# EAGLE design io-16x-fused-fm_v1.0.0 (EAGLE 9.6.2)
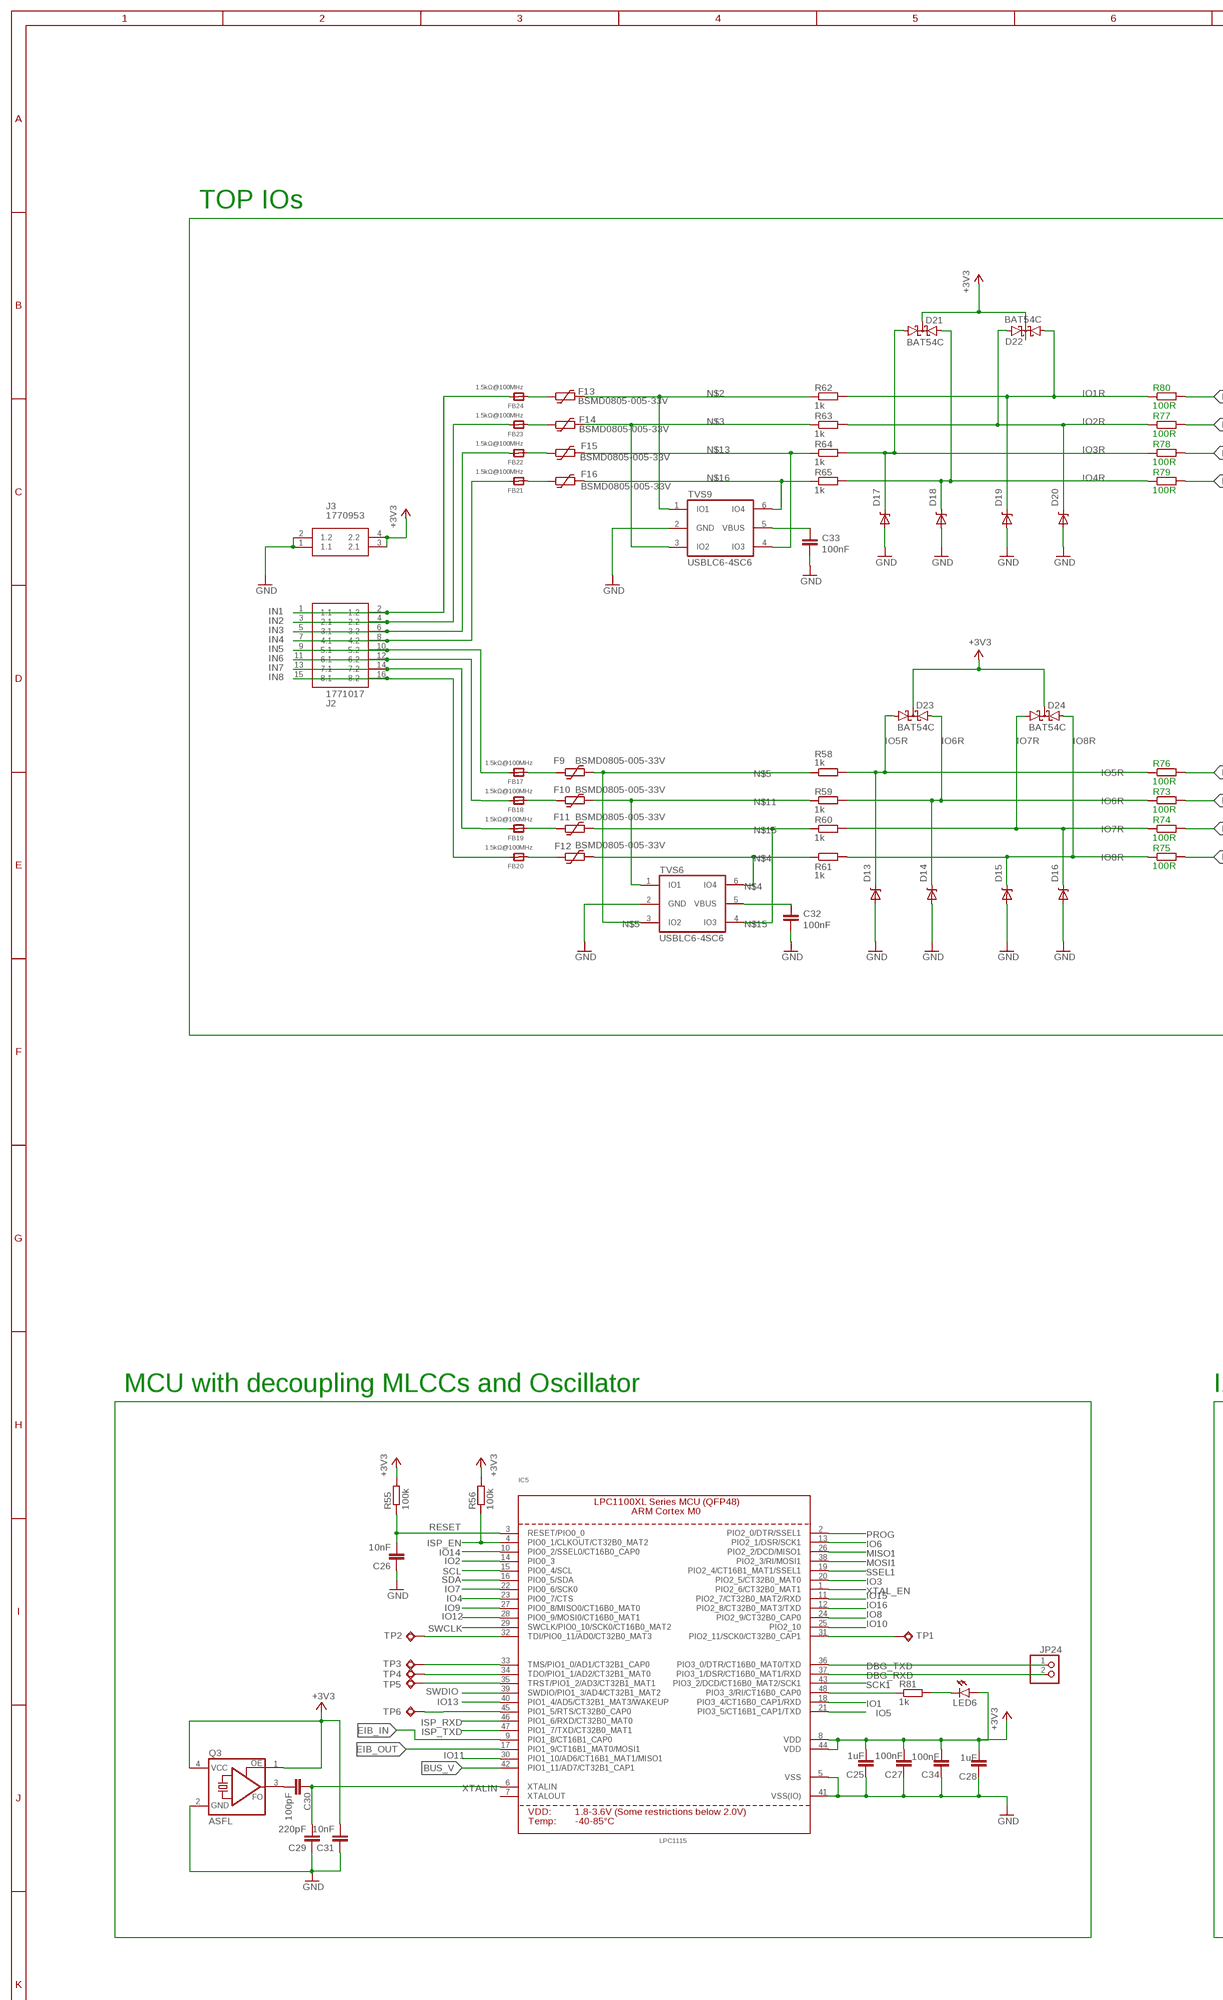
[diagram p0: schematic, sheet 1, part 1 of 3]
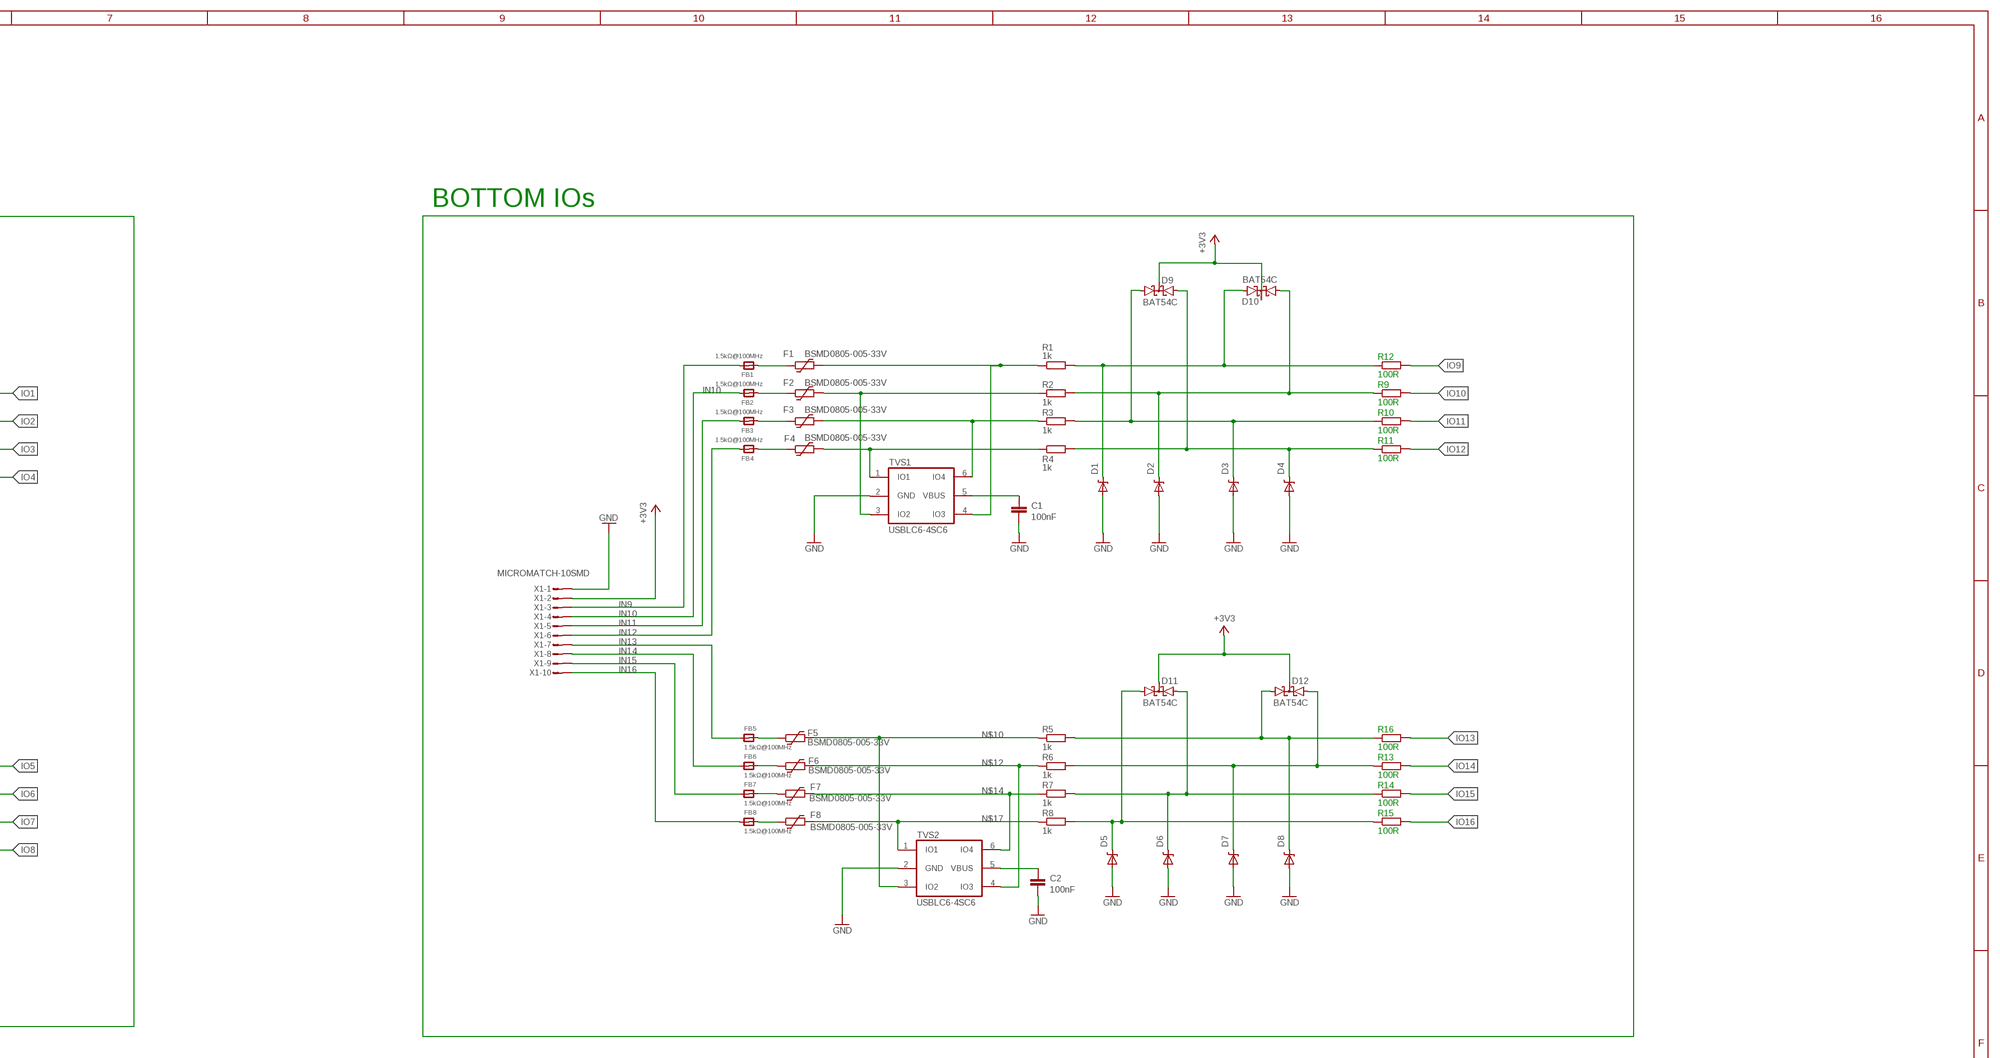
[diagram p1: schematic, sheet 1, part 2 of 3]
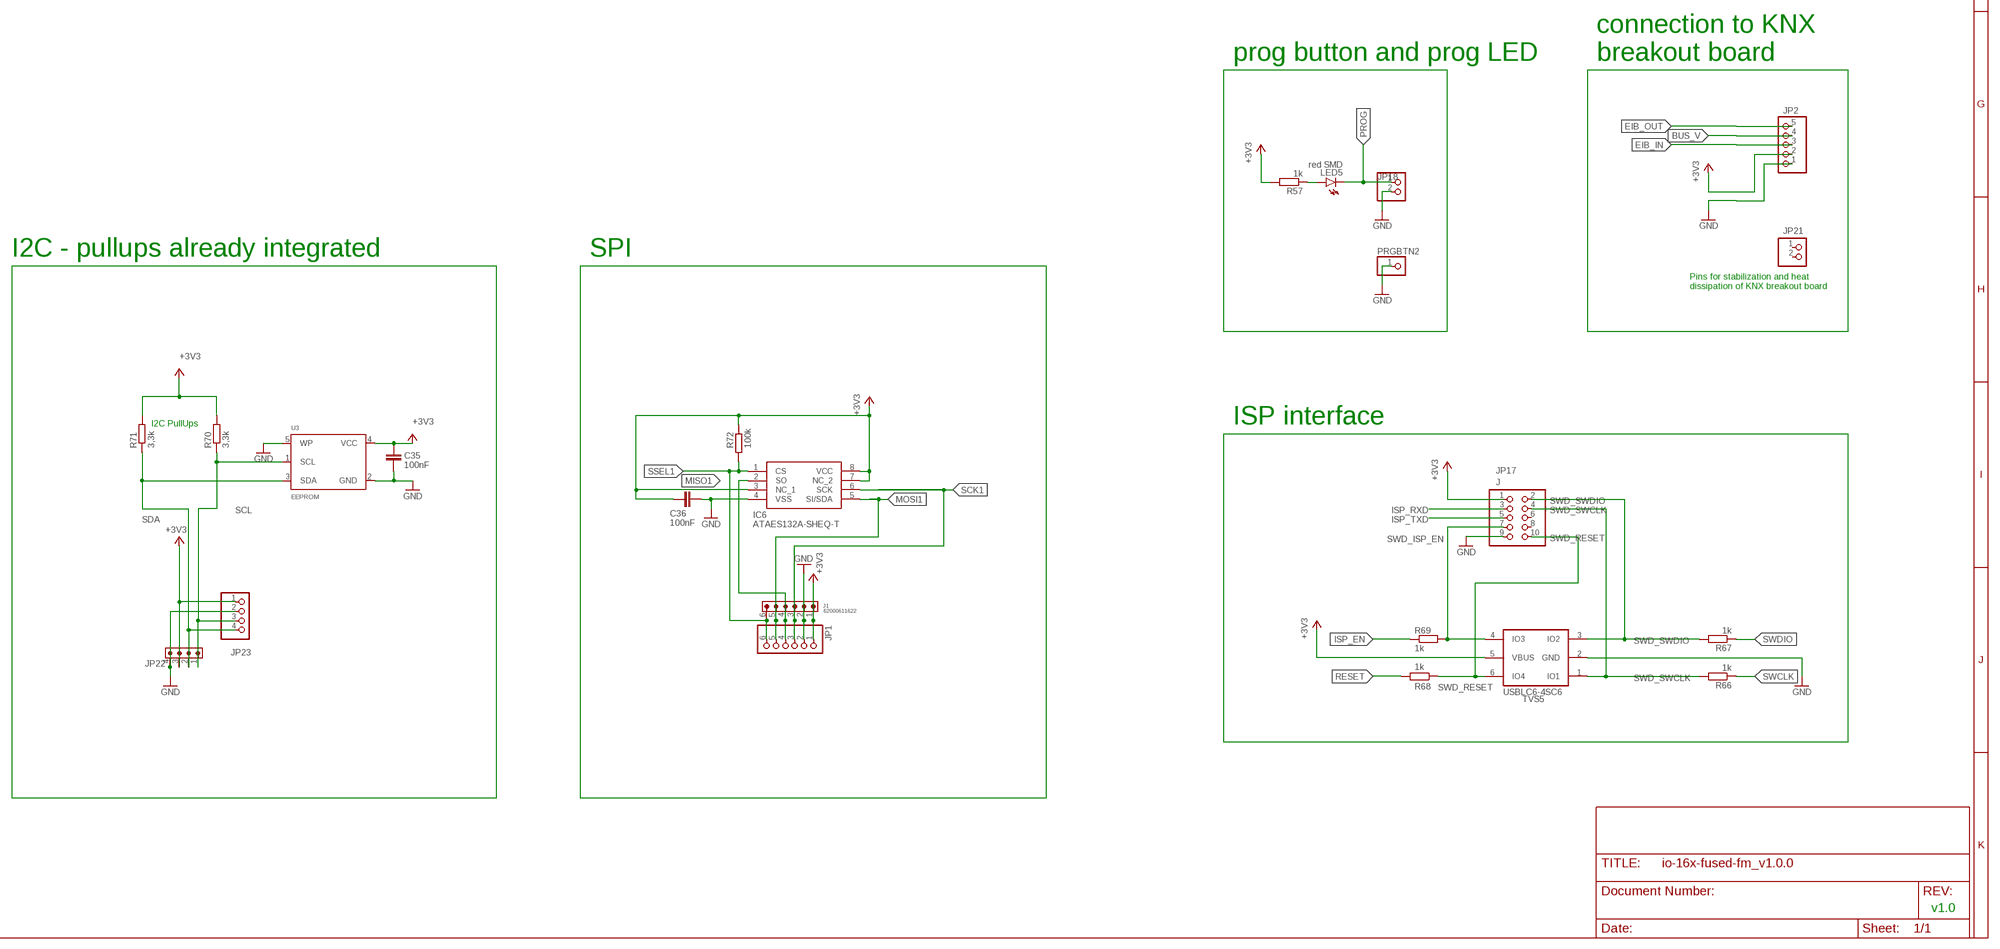
[diagram p2: schematic, sheet 1, part 3 of 3]

## Parts
C1  100nF  C-EUC0805  [C0805]
C2  100nF  C-EUC0805  [C0805]
C25  1uF  C-EUC0805  [C0805]
C26  10nF  C-EUC0805  [C0805]
C27  100nF  C-EUC0805  [C0805]
C28  1uF  C-EUC0805  [C0805]
C29  220pF  C-EUC0805  [C0805]
C30  100pF  C-EUC0805  [C0805]
C31  10nF  C-EUC0805  [C0805]
C32  100nF  C-EUC0805  [C0805]
C33  100nF  C-EUC0805  [C0805]
C34  100nF  C-EUC0805  [C0805]
C35  100nF  C-EUC0805  [C0805]
C36  100nF  C-EUC0805  [C0805]
D1  DDZ9684  DIODE-ZENERSOD-123  [SOD-123]
D2  DDZ9684  DIODE-ZENERSOD-123  [SOD-123]
D3  DDZ9684  DIODE-ZENERSOD-123  [SOD-123]
D4  DDZ9684  DIODE-ZENERSOD-123  [SOD-123]
D5  DDZ9684  DIODE-ZENERSOD-123  [SOD-123]
D6  DDZ9684  DIODE-ZENERSOD-123  [SOD-123]
D7  DDZ9684  DIODE-ZENERSOD-123  [SOD-123]
D8  DDZ9684  DIODE-ZENERSOD-123  [SOD-123]
D9  BAT54C  [SOT23]
D10  BAT54C  [SOT23]
D11  BAT54C  [SOT23]
D12  BAT54C  [SOT23]
D13  DDZ9684  DIODE-ZENERSOD-123  [SOD-123]
D14  DDZ9684  DIODE-ZENERSOD-123  [SOD-123]
D15  DDZ9684  DIODE-ZENERSOD-123  [SOD-123]
D16  DDZ9684  DIODE-ZENERSOD-123  [SOD-123]
D17  DDZ9684  DIODE-ZENERSOD-123  [SOD-123]
D18  DDZ9684  DIODE-ZENERSOD-123  [SOD-123]
D19  DDZ9684  DIODE-ZENERSOD-123  [SOD-123]
D20  DDZ9684  DIODE-ZENERSOD-123  [SOD-123]
D21  BAT54C  [SOT23]
D22  BAT54C  [SOT23]
D23  BAT54C  [SOT23]
D24  BAT54C  [SOT23]
F1  BSMD0805-005-33V  0805L035  [0805L]
F2  BSMD0805-005-33V  0805L035  [0805L]
F3  BSMD0805-005-33V  0805L035  [0805L]
F4  BSMD0805-005-33V  0805L035  [0805L]
F5  BSMD0805-005-33V  0805L035  [0805L]
F6  BSMD0805-005-33V  0805L035  [0805L]
F7  BSMD0805-005-33V  0805L035  [0805L]
F8  BSMD0805-005-33V  0805L035  [0805L]
F9  BSMD0805-005-33V  0805L035  [0805L]
F10  BSMD0805-005-33V  0805L035  [0805L]
F11  BSMD0805-005-33V  0805L035  [0805L]
F12  BSMD0805-005-33V  0805L035  [0805L]
F13  BSMD0805-005-33V  0805L035  [0805L]
F14  BSMD0805-005-33V  0805L035  [0805L]
F15  BSMD0805-005-33V  0805L035  [0805L]
F16  BSMD0805-005-33V  0805L035  [0805L]
FB1  1.5kΩ@100MHz  FERRITE2_0805MP  [FERR_0805MP]
FB2  1.5kΩ@100MHz  FERRITE2_0805MP  [FERR_0805MP]
FB3  1.5kΩ@100MHz  FERRITE2_0805MP  [FERR_0805MP]
FB4  1.5kΩ@100MHz  FERRITE2_0805MP  [FERR_0805MP]
FB5  1.5kΩ@100MHz  FERRITE2_0805MP  [FERR_0805MP]
FB6  1.5kΩ@100MHz  FERRITE2_0805MP  [FERR_0805MP]
FB7  1.5kΩ@100MHz  FERRITE2_0805MP  [FERR_0805MP]
FB8  1.5kΩ@100MHz  FERRITE2_0805MP  [FERR_0805MP]
FB17  1.5kΩ@100MHz  FERRITE2_0805MP  [FERR_0805MP]
FB18  1.5kΩ@100MHz  FERRITE2_0805MP  [FERR_0805MP]
FB19  1.5kΩ@100MHz  FERRITE2_0805MP  [FERR_0805MP]
FB20  1.5kΩ@100MHz  FERRITE2_0805MP  [FERR_0805MP]
FB21  1.5kΩ@100MHz  FERRITE2_0805MP  [FERR_0805MP]
FB22  1.5kΩ@100MHz  FERRITE2_0805MP  [FERR_0805MP]
FB23  1.5kΩ@100MHz  FERRITE2_0805MP  [FERR_0805MP]
FB24  1.5kΩ@100MHz  FERRITE2_0805MP  [FERR_0805MP]
IC5  LPC1115  LPC1113/4/5_QFP48_XLSERIES  [LQFP48]
IC6  ATAES132A-SHEQ-T  [SOIC127P600X175-8N]
J1  62000611622  62000611622  [62000611622]
J2  1771017  [1771017]
J3  1770953  [1770953]
JP1  PINHD-1X06_2.54-S  [1X06-S]
JP2  PINHD-1X5  [1X05]
JP17  J  PINHD-2X05_2.00  [2X05M]
JP18  PINHD-1X2  [1X02]
JP21  PINHD-1X2  [1X02]
JP22  62000411622  62000411622  [62000411622]
JP23  PINHD-1X4  [1X04]
JP24  PINHD-1X2  [1X02]
LED5  red SMD  LEDCHIPLED_0805  [CHIPLED_0805]
LED6  LEDCHIPLED_0805  [CHIPLED_0805]
PRGBTN2  PINHD-1X1  [1X01]
Q3  ASFL  [ASF]
R1  1k  R-EU_R0805  [R0805]
R2  1k  R-EU_R0805  [R0805]
R3  1k  R-EU_R0805  [R0805]
R4  1k  R-EU_R0805  [R0805]
R5  1k  R-EU_R0805  [R0805]
R6  1k  R-EU_R0805  [R0805]
R7  1k  R-EU_R0805  [R0805]
R8  1k  R-EU_R0805  [R0805]
R9  100R  R-EU_R0805  [R0805]
R10  100R  R-EU_R0805  [R0805]
R11  100R  R-EU_R0805  [R0805]
R12  100R  R-EU_R0805  [R0805]
R13  100R  R-EU_R0805  [R0805]
R14  100R  R-EU_R0805  [R0805]
R15  100R  R-EU_R0805  [R0805]
R16  100R  R-EU_R0805  [R0805]
R55  100k  R-EU_R0805  [R0805]
R56  100k  R-EU_R0805  [R0805]
R57  1k  R-EU_R0805  [R0805]
R58  1k  R-EU_R0805  [R0805]
R59  1k  R-EU_R0805  [R0805]
R60  1k  R-EU_R0805  [R0805]
R61  1k  R-EU_R0805  [R0805]
R62  1k  R-EU_R0805  [R0805]
R63  1k  R-EU_R0805  [R0805]
R64  1k  R-EU_R0805  [R0805]
R65  1k  R-EU_R0805  [R0805]
R66  1k  R-EU_R0805  [R0805]
R67  1k  R-EU_R0805  [R0805]
R68  1k  R-EU_R0805  [R0805]
R69  1k  R-EU_R0805  [R0805]
R70  3,3k  R-EU_R0805  [R0805]
R71  3,3k  R-EU_R0805  [R0805]
R72  100k  R-EU_R0805  [R0805]
R73  100R  R-EU_R0805  [R0805]
R74  100R  R-EU_R0805  [R0805]
R75  100R  R-EU_R0805  [R0805]
R76  100R  R-EU_R0805  [R0805]
R77  100R  R-EU_R0805  [R0805]
R78  100R  R-EU_R0805  [R0805]
R79  100R  R-EU_R0805  [R0805]
R80  100R  R-EU_R0805  [R0805]
R81  1k  R-EU_R0805  [R0805]
TP1  TPSQTP08R  [TP08R]
TP2  TPSQTP08R  [TP08R]
TP3  TPSQTP08R  [TP08R]
TP4  TPSQTP08R  [TP08R]
TP5  TPSQTP08R  [TP08R]
TP6  TPSQTP08R  [TP08R]
TVS1  USBLC6-4SC6  [SOT-23-6L]
TVS2  USBLC6-4SC6  [SOT-23-6L]
TVS5  USBLC6-4SC6  [SOT-23-6L]
TVS6  USBLC6-4SC6  [SOT-23-6L]
TVS9  USBLC6-4SC6  [SOT-23-6L]
U3  EEPROM  EEPROM_I2C_MCP24AA32  [SOT23-5]
X1  MICROMATCH-10SMD  [MICROMATCH-10SMD]

## Nets
+3V3: C25.2 C27.2 C28.2 C31.2 C34.2 C35.1 C36.1 D9.3(CC) D10.3(CC) D11.3(CC) D12.3(CC) D21.3(CC) D22.3(CC) D23.3(CC) D24.3(CC) IC5.8(VDD) IC5.44(VDD) IC6.3(NC_1) IC6.7(NC_2) IC6.8(VCC) J1.1 J3.3(2.1) J3.4(2.2) JP1.1 JP2.2 JP17.1 JP22.3 JP23.1 LED6.A Q3.1(OE) Q3.4(VCC) R55.2 R56.2 R57.2 R70.2 R71.2 R72.2 TVS5.5(VBUS) U3.4(VCC) X1.2
BUS_V: IC5.42(PIO1_11/AD7/CT32B1_CAP1) JP2.4
DBG_RXD: IC5.37(PIO3_1/DSR/CT16B0_MAT1/RXD) JP24.2
DBG_TXD: IC5.36(PIO3_0/DTR/CT16B0_MAT0/TXD) JP24.1
EIB_IN: IC5.9(PIO1_8/CT16B1_CAP0) JP2.3
EIB_OUT: IC5.17(PIO1_9/CT16B1_MAT0/MOSI1) JP2.5
GND: C1.1 C2.1 C25.1 C26.1 C27.1 C28.1 C29.1 C31.1 C32.1 C33.1 C34.1 C35.2 C36.2 D1.A D2.A D3.A D4.A D5.A D6.A D7.A D8.A D13.A D14.A D15.A D16.A D17.A D18.A D19.A D20.A IC5.5(VSS) IC5.41(VSS(IO)) IC6.4(VSS) J1.2 J3.1(1.1) J3.2(1.2) JP1.2 JP2.1 JP17.9 JP18.2 JP22.4 JP23.2 PRGBTN2.1 Q3.2(GND) TVS1.2(GND) TVS2.2(GND) TVS5.2(GND) TVS6.2(GND) TVS9.2(GND) U3.2(GND) U3.5(WP) X1.1
IN1: FB24.2 J2.1(1.1) J2.2(1.2)
IN2: FB23.2 J2.3(2.1) J2.4(2.2)
IN3: FB22.2 J2.5(3.1) J2.6(3.2)
IN4: FB21.2 J2.7(4.1) J2.8(4.2)
IN5: FB17.2 J2.9(5.1) J2.10(5.2)
IN6: FB18.2 J2.11(6.1) J2.12(6.2)
IN7: FB19.2 J2.13(7.1) J2.14(7.2)
IN8: FB20.2 J2.15(8.1) J2.16(8.2)
IN9: FB1.2 X1.3
IN10: FB2.2 X1.4
IN11: FB3.2 X1.5
IN12: FB4.2 X1.6
IN13: FB5.1 X1.7
IN14: FB6.1 X1.8
IN15: FB7.1 X1.9
IN16: FB8.1 X1.10
IO1: IC5.18(PIO3_4/CT16B0_CAP1/RXD) R80.2
IO1R: D19.C D22.1(A1) R62.2 R80.1
IO2: IC5.14(PIO0_3) R77.2
IO2R: D20.C D22.2(A2) R63.2 R77.1
IO3: IC5.20(PIO2_5/CT32B0_MAT0) R78.2
IO3R: D17.C D21.1(A1) R64.2 R78.1
IO4: IC5.23(PIO0_7/CTS) R79.2
IO4R: D18.C D21.2(A2) R65.2 R79.1
IO5: IC5.21(PIO3_5/CT16B1_CAP1/TXD) R76.2
IO5R: D13.C D23.1(A1) R58.2 R76.1
IO6: IC5.13(PIO2_1/DSR/SCK1) R73.2
IO6R: D14.C D23.2(A2) R59.2 R73.1
IO7: IC5.22(PIO0_6/SCK0) R74.2
IO7R: D16.C D24.1(A1) R60.2 R74.1
IO8: IC5.24(PIO2_9/CT32B0_CAP0) R75.2
IO8R: D15.C D24.2(A2) R61.2 R75.1
IO9: IC5.27(PIO0_8/MISO0/CT16B0_MAT0) R12.2
IO10: IC5.25(PIO2_10) R9.2
IO11: IC5.30(PIO1_10/AD6/CT16B1_MAT1/MISO1) R10.2
IO12: IC5.28(PIO0_9/MOSI0/CT16B0_MAT1) R11.2
IO13: IC5.40(PIO1_4/AD5/CT32B1_MAT3/WAKEUP) R16.2
IO14: IC5.10(PIO0_2/SSEL0/CT16B0_CAP0) R13.2
IO15: IC5.11(PIO2_7/CT32B0_MAT2/RXD) R14.2
IO16: IC5.12(PIO2_8/CT32B0_MAT3/TXD) R15.2
ISP_EN: IC5.4(PIO0_1/CLKOUT/CT32B0_MAT2) R56.1 R69.1
ISP_RXD: IC5.46(PIO1_6/RXD/CT32B0_MAT0) JP17.3
ISP_TXD: IC5.47(PIO1_7/TXD/CT32B0_MAT1) JP17.5
MISO1: IC5.26(PIO2_2/DCD/MISO1) IC6.2(SO) J1.4 JP1.4
MOSI1: IC5.38(PIO2_3/RI/MOSI1) IC6.5(SI/SDA) J1.5 JP1.5
N$1: C30.2 Q3.3(FO)
N$2: F13.2 R62.1 TVS9.1(IO1)
N$3: F14.2 R63.1 TVS9.3(IO2)
N$4: F12.2 R61.1 TVS6.6(IO4)
N$5: F9.2 R58.1 TVS6.3(IO2)
N$6: F5.1 FB5.2
N$7: F6.1 FB6.2
N$8: F7.1 FB7.2
N$9: F8.1 FB8.2
N$10: F5.2 R5.1 TVS2.3(IO2)
N$11: F10.2 R59.1 TVS6.1(IO1)
N$12: F6.2 R6.1 TVS2.4(IO3)
N$13: F15.2 R64.1 TVS9.4(IO3)
N$14: F7.2 R7.1 TVS2.6(IO4)
N$15: F11.2 R60.1 TVS6.4(IO3)
N$16: F16.2 R65.1 TVS9.6(IO4)
N$17: F8.2 R8.1 TVS2.1(IO1)
N$18: D8.C D12.1(A1) R5.2 R16.1
N$19: D7.C D12.2(A2) R6.2 R13.1
N$20: IC5.45(PIO1_5/RTS/CT32B0_CAP0) TP6.TP
N$26: LED5.A R57.1
N$27: IC5.32(TDI/PIO0_11/AD0/CT32B0_MAT3) TP2.TP
N$28: C32.2 TVS6.5(VBUS)
N$29: C33.2 TVS9.5(VBUS)
N$30: F11.1 FB19.1
N$31: F12.1 FB20.1
N$32: F10.1 FB18.1
N$33: F9.1 FB17.1
N$34: F16.1 FB21.1
N$35: F15.1 FB22.1
N$36: F13.1 FB24.1
N$37: F14.1 FB23.1
N$38: LED6.C R81.2
N$39: IC5.48(PIO3_3/RI/CT16B0_CAP0) R81.1
N$43: D6.C D11.2(A2) R7.2 R14.1
N$44: D5.C D11.1(A1) R8.2 R15.1
N$45: C1.2 TVS1.5(VBUS)
N$46: IC5.33(TMS/PIO1_0/AD1/CT32B1_CAP0) TP3.TP
N$47: F1.1 FB1.1
N$48: F2.1 FB2.1
N$49: F3.1 FB3.1
N$50: F4.1 FB4.1
N$51: F4.2 R4.1 TVS1.1(IO1)
N$52: F3.2 R3.1 TVS1.6(IO4)
N$53: F2.2 R2.1 TVS1.3(IO2)
N$54: F1.2 R1.1 TVS1.4(IO3)
N$55: D1.C D10.2(A2) R1.2 R12.1
N$56: D2.C D10.1(A1) R2.2 R9.1
N$57: D3.C D9.1(A1) R3.2 R10.1
N$58: D4.C D9.2(A2) R4.2 R11.1
N$59: C2.2 TVS2.5(VBUS)
N$60: IC5.34(TDO/PIO1_1/AD2/CT32B1_MAT0) TP4.TP
N$61: IC5.35(TRST/PIO1_2/AD3/CT32B1_MAT1) TP5.TP
N$62: IC5.31(PIO2_11/SCK0/CT32B0_CAP1) TP1.TP
PROG: IC5.2(PIO2_0/DTR/SSEL1) JP18.1 LED5.C
RESET: C26.2 IC5.3(RESET/PIO0_0) R55.1 R68.2
SCK1: IC5.43(PIO3_2/DCD/CT16B0_MAT2/SCK1) IC6.6(SCK) J1.3 JP1.3
SCL: IC5.15(PIO0_4/SCL) JP22.1 JP23.3 R70.1 U3.1(SCL)
SDA: IC5.16(PIO0_5/SDA) JP22.2 JP23.4 R71.1 U3.3(SDA)
SSEL1: IC5.19(PIO2_4/CT16B1_MAT1/SSEL1) IC6.1(CS) J1.6 JP1.6 R72.1
SWCLK: IC5.29(SWCLK/PIO0_10/SCK0/CT16B0_MAT2) R66.1
SWD_ISP_EN: JP17.7 R69.2 TVS5.4(IO3)
SWD_RESET: JP17.10 R68.1 TVS5.6(IO4)
SWD_SWCLK: JP17.4 R66.2 TVS5.1(IO1)
SWD_SWDIO: JP17.2 R67.2 TVS5.3(IO2)
SWDIO: IC5.39(SWDIO/PIO1_3/AD4/CT32B1_MAT2) R67.1
XTAL_EN: IC5.1(PIO2_6/CT32B0_MAT1)
XTALIN: C29.2 C30.1 IC5.6(XTALIN)
Unconnected: IC5.7(XTALOUT) JP17.6 JP17.8 JP21.1 JP21.2

## Notes on the sheet
- TOP IOs | BOTTOM IOs
- prog button and prog LED
- connection to KNX 
  breakout board
- MCU with decoupling MLCCs and Oscillator | I2C - pullups already integrated | SPI
- Pins for stabilization and heat 
  dissipation of KNX breakout board
- I2C PullUps
- ISP interface
- v1.0

## Library data of the parts
C1 C2 C25-C36 = rcl:C-EU: CAPACITOR, European symbol; SPICEPREFIX: C
D1-D8 D13-D20 = Diode_for_Selfbus-Projects:DIODE-ZENER: Zener Diode SMA: 30V 1W Zener Diode, 1.2Vf - Digikey: SMAZ30-FDICT-ND
D9-D12 D21-D24 = diode:BAT54C: Schottky Diodes Source: Fairchild .. BAT54.pdf
F1-F16 = polyfuse-smd_10:?: Polyfuse Resettable PTC Source: http://www.littelfuse.com/products/resettable-ptcs.aspx; MF: Littelfuse; MPN: 0805L035; OC_FARNELL: 1832102RL; OC_NEWARK: 18M4775
FB1-FB8 FB17-FB24 = RCL_for_Selfbus-Projects:FERRITE2: Ferrite Bead 0603 MMZ1608B121C - 120 Ohm @ 100MHz, 600mA, 0.15 Ohm DC Resistance - Digikey: 445-2164-1-ND BK1608HW121-T - 120 Ohm, 600mA Ferrite Chip - Digikey: 587-1876-2-ND 0805 HZ0805B272R-10 - 2.7K Ohm @ 100MHz, 200mA, 0.8 Ohm DC Resistance - Digikey: 240-2504-1-ND (see also Murata BLM21BD272SN1L) MMZ2012Y152B - 1.5K Ohm @ 100MHz, 500mA, 0.4 Ohm DC Resistance - Digikey: 445-1560-1-ND - Mainly for high frequency (80-400MHz) MMZ2012R102A - 1K Ohm @ 100MHz, 500mA, 0.3 Ohm DC Resistance - Digikey: 445-1555-2-ND - More general purpose (10-200MHz)
IC5 = IC_for_Selfbus-Projects:LPC1113/4/5_QFP48_XLSERIES: LPC1113/4/5 ARM Cortex M0 MCU (50MHz) - XL Series (FBD48/3x3) LPC1115FBD48/303: Max Frequency: 50MHz Flash: 64kB SRAM: 8kB ADC: 10-bit
IC6 = SamacSys_Parts:ATAES132A-SHEQ-T: Security ICs / Authentication ICs 32Kbit AES Auth SPI soic(S), GR Source: Datasheet <http://www.microchip.com/mymicrochip/filehandler.aspx?ddocname=en590569>; DESCRIPTION: Security ICs / Authentication ICs 32Kbit AES Auth SPI soic(S), GR; HEIGHT: 1.75mm; MANUFACTURER_NAME: Microchip; MANUFACTURER_PART_NUMBER: ATAES132A-SHEQ-T; MOUSER_PART_NUMBER: 556-ATAES132A-SHEQ-T; MOUSER_PRICE-STOCK: https://www.mouser.co.uk/ProductDetail/Microchip-Technology-Atmel/ATAES132A-SHEQ-T?qs=9KdFJXLqUo%252BeCVGZWjCBZQ%3D%3D
J1 = Wurth_Connectors_WR-WTB:62000611622: WR-WTB 2.00 mm Male Vertical Shrouded Header KIND PROPERTIES: Pitch 2 mm Gender Male Type Vertical MATERIAL PROPERTIES: Insulator Material LCP Insulator Flammability Rating UL94 V-0 Insulator Color Beige; White Contact Material Copper Alloy Contact Plating Tin Contact Type Stamped GENERAL INFORMATION Operating Temperature -25 up to +85 °C IR 2 A Working Voltage 125 V (AC) Withstanding Voltage 800 V (AC) Contact Resistance 20 mΩ RISO 1000 MΩ CERTIFICATION UL Approval E323964 PACKAGING PROPERTIES Packaging Bag <https://www.we-online.com/catalog/media/o33351v209%20Family_WR-WTB_6200xx11622.jpg> Details see: www.we-online.com/catalog/WTB_2_00_MALE_VERTICAL_SHROUDED_HEADER_6200XX11622 <www.we-online.com/catalog/WTB_2_00_MALE_VERTICAL_SHROUDED_HEADER_6200XX11622/?utm_source=eagle_model&utm_medium=description_link&utm_campaign=eisos_eagle> Updated by Ella Wu 2022-07-27 2022 (C) Würth Elektronik; CONTACT-RESISTANCE: 20mOhm; DATASHEET-URL: https://www.we-online.com/redexpert/spec/62000611622?ae; GENDER: Male; IR: 2A; L: 14mm; MOUNT: THT; PACKAGING: Bag; PART-NUMBER: 62000611622; PCB-CABLE-PANEL: PCB; PINS: 6; PITCH: 2mm; TYPE: Vertical; WORKING-VOLTAGE: 125V(AC)
J2 = SamacSys_Parts:1771017: PCB terminal block, nominal current: 6 A, rated voltage (III/2): 160 V, nominal cross section: 0.5 mm?, Number of potentials: 8, Number of rows: 1, Number of positions per row: 8, product range: PTSM 0,5/..-V-THR, pitch: 2.5 mm, connection method: Push-in spring connection, mounting: THR soldering, conductor/PCB connection direction: 90 ?, color: black, Pin layout: Linear double pinning, Solder pin [P]: 2.1 mm, type of packaging: 44 mm wide tape Source: Datasheet <http://www.phoenixcontact.com/de/produkte/1771017/pdf>; DESCRIPTION: PCB terminal block, nominal current: 6 A, rated voltage (III/2): 160 V, nominal cross section: 0.5 mm?, Number of potentials: 8, Number of rows: 1, Number of positions per row: 8, product range: PTSM 0,5/..-V-THR, pitch: 2.5 mm, connection method: Push-in spring connection, mounting: THR soldering, conductor/PCB connection direction: 90 ?, color: black, Pin layout: Linear double pinning, Solder pin [P]: 2.1 mm, type of packaging: 44 mm wide tape; HEIGHT: 10.15mm; MANUFACTURER_NAME: Phoenix Contact; MANUFACTURER_PART_NUMBER: 1771017; MOUSER_PART_NUMBER: 651-1771017; MOUSER_PRICE-STOCK: https://www.mouser.co.uk/ProductDetail/Phoenix-Contact/1771017?qs=Q77YN%2FRrsKK4oJ9UqLQEMA%3D%3D
J3 = SamacSys_Parts:1770953: PCB terminal block, nominal current: 6 A, rated voltage (III/2): 160 V, nominal cross section: 0.5 mm?, Number of potentials: 2, Number of rows: 1, Number of positions per row: 2, product range: PTSM 0,5/..-V-THR, pitch: 2.5 mm, connection method: Push-in spring connection, mounting: THR soldering, conductor/PCB connection direction: 90 ?, color: black, Pin layout: Linear double pinning, Solder pin [P]: 2.1 mm, type of packaging: 44 mm wide tape Source: Datasheet <http://www.phoenixcontact.com/de/produkte/1770953/pdf>; DESCRIPTION: PCB terminal block, nominal current: 6 A, rated voltage (III/2): 160 V, nominal cross section: 0.5 mm?, Number of potentials: 2, Number of rows: 1, Number of positions per row: 2, product range: PTSM 0,5/..-V-THR, pitch: 2.5 mm, connection method: Push-in spring connection, mounting: THR soldering, conductor/PCB connection direction: 90 ?, color: black, Pin layout: Linear double pinning, Solder pin [P]: 2.1 mm, type of packaging: 44 mm wide tape; HEIGHT: 10.15mm; MANUFACTURER_NAME: Phoenix Contact; MANUFACTURER_PART_NUMBER: 1770953; MOUSER_PART_NUMBER: 651-1770953; MOUSER_PRICE-STOCK: https://www.mouser.co.uk/ProductDetail/Phoenix-Contact/1770953?qs=Q77YN%2FRrsKI3rV0n%2FVy3jA%3D%3D
JP1 = pinhead-2:PINHD-1X06: PIN HEADER
JP2 = pinhead_dmx:PINHD-1X5: PIN HEADER
JP17 = Connector_for_Selfbus-Projects:PINHD-2X05: PIN HEADER; REICHELT: MPE 150-3-010
JP18 JP21 JP24 = pinhead_dmx:PINHD-1X2: PIN HEADER
JP22 = Eagle_WR-WTB (rev22a):62000411622: WR-WTB 2.00 mm Male Vertical Shrouded Header KIND PROPERTIES: Pitch 2 mm Gender Male Type Vertical MATERIAL PROPERTIES: Insulator Material LCP Insulator Flammability Rating UL94 V-0 Insulator Color Beige; White Contact Material Copper Alloy Contact Plating Tin Contact Type Stamped GENERAL INFORMATION Operating Temperature -25 up to +85 °C IR 2 A Working Voltage 125 V (AC) Withstanding Voltage 800 V (AC) Contact Resistance 20 mΩ RISO 1000 MΩ CERTIFICATION UL Approval E323964 PACKAGING PROPERTIES Packaging Bag <https://www.we-online.com/catalog/media/o33351v209%20Family_WR-WTB_6200xx11622.jpg> Details see: www.we-online.com/catalog/WTB_2_00_MALE_VERTICAL_SHROUDED_HEADER_6200XX11622 <www.we-online.com/catalog/WTB_2_00_MALE_VERTICAL_SHROUDED_HEADER_6200XX11622/?utm_source=eagle_model&utm_medium=description_link&utm_campaign=eisos_eagle> Updated by Ella Wu 2022-07-27 2022 (C) Würth Elektronik; CONTACT-RESISTANCE: 20mOhm; DATASHEET-URL: https://www.we-online.com/redexpert/spec/62000411622?ae; GENDER: Male; IR: 2A; L: 10mm; MOUNT: THT; PACKAGING: Bag; PART-NUMBER: 62000411622; PCB-CABLE-PANEL: PCB; PINS: 4; PITCH: 2mm; TYPE: Vertical; WORKING-VOLTAGE: 125V(AC)
JP23 = pinhead_dmx:PINHD-1X4: PIN HEADER
LED5 LED6 = led:LED: LED OSRAM: - CHIPLED LG R971, LG N971, LY N971, LG Q971, LY Q971, LO R971, LY R971 LH N974, LH R974 LS Q976, LO Q976, LY Q976 LO Q996 - Hyper CHIPLED LW Q18S LB Q993, LB Q99A, LB R99A - SideLED LS A670, LO A670, LY A670, LG A670, LP A670 LB A673, LV A673, LT A673, LW A673 LH A674 LY A675 LS A676, LA A676, LO A676, LY A676, LW A676 LS A679, LY A679, LG A679 - Hyper Micro SIDELED® LS Y876, LA Y876, LO Y876, LY Y876 LT Y87S - SmartLED LW L88C, LW L88S LB L89C, LB L89S, LG L890 LS L89K, LO L89K, LY L89K LS L896, LA L896, LO L896, LY L896 - TOPLED LS T670, LO T670, LY T670, LG T670, LP T670 LSG T670, LSP T670, LSY T670, LOP T670, LYG T670 LG T671, LOG T671, LSG T671 LB T673, LV T673, LT T673, LW T673 LH T674 LS T676, LA T676, LO T676, LY T676, LB T676, LH T676, LSB T676, LW T676 LB T67C, LV T67C, LT T67C, LS T67K, LO T67K, LY T67K, LW E67C LS E67B, LA E67B, LO E67B, LY E67B, LB E67C, LV E67C, LT E67C LW T67C LS T679, LY T679, LG T679 LS T770, LO T770, LY T770, LG T770, LP T770 LB T773, LV T773, LT T773, LW T773 LH T774 LS E675, LA E675, LY E675, LS T675 LS T776, LA T776, LO T776, LY T776, LB T776 LHGB T686 LT T68C, LB T68C - Hyper Mini TOPLED® LB M676 - Mini TOPLED Santana® LG M470 LS M47K, LO M47K, LY M47K Source: http://www.osram.convergy.de LUXEON: - LUMILED® LXK2-PW12-R00, LXK2-PW12-S00, LXK2-PW14-U00, LXK2-PW14-V00 LXK2-PM12-R00, LXK2-PM12-S00, LXK2-PM14-U00 LXK2-PE12-Q00, LXK2-PE12-R00, LXK2-PE12-S00, LXK2-PE14-T00, LXK2-PE14-U00 LXK2-PB12-K00, LXK2-PB12-L00, LXK2-PB12-M00, LXK2-PB14-N00, LXK2-PB14-P00, LXK2-PB14-Q00 LXK2-PR12-L00, LXK2-PR12-M00, LXK2-PR14-Q00, LXK2-PR14-R00 LXK2-PD12-Q00, LXK2-PD12-R00, LXK2-PD12-S00 LXK2-PH12-R00, LXK2-PH12-S00 LXK2-PL12-P00, LXK2-PL12-Q00, LXK2-PL12-R00 Source: www.luxeon.com KINGBRIGHT: KA-3528ASYC Source: www.kingbright.com
PRGBTN2 = pinhead_dmx:PINHD-1X1: PIN HEADER
Q3 = crystal:ASF*: CRYSTAL CLOCK OSCILLATORS 5.0 Vdc or 3.3 Vdc - LOW PROFILE ULTRA MINIATURE CERAMIC SURFACE MOUNT Source: http://www.abracon.com/Oscillators/asf1-L-L1.pdf; MPN: ASFLM1-50.000MHZ-C-T; OC_FARNELL: 1838931; OC_NEWARK: 99M0411
R1-R16 R55-R81 = rcl:R-EU_: RESISTOR, European symbol; SPICEPREFIX: R
TP1-TP6 = testpad:TPSQ: Test pad
TVS1 TVS2 TVS5 TVS6 TVS9 = usblc6:USBLC6-4: Very low capacitance ESD protection 4 line Features 4 data-line protection Protects V BUS Very low capacitance: 3 pF Very low leakage current: 10 nA Peak pulse power (8/20 μs): 130 W typ. SOT23-6L package RoHS compliant Datasheet <https://www.st.com/resource/en/datasheet/usblc6-4.pdf>
U3 = microbuilder:EEPROM_I2C_MCP24AA32: Microchip 32K (4K x 8) 1.8V I2C EEPROM SOT23-5 [Digikey: 24AA32AFT-I/OTCT-ND]
X1 = con-amp-micromatch:MICROMATCH-10: MicroMaTch 10 8-215464-0 / 1-215464-0 Drawing Number C-215464 DDEController.pdf

## Board
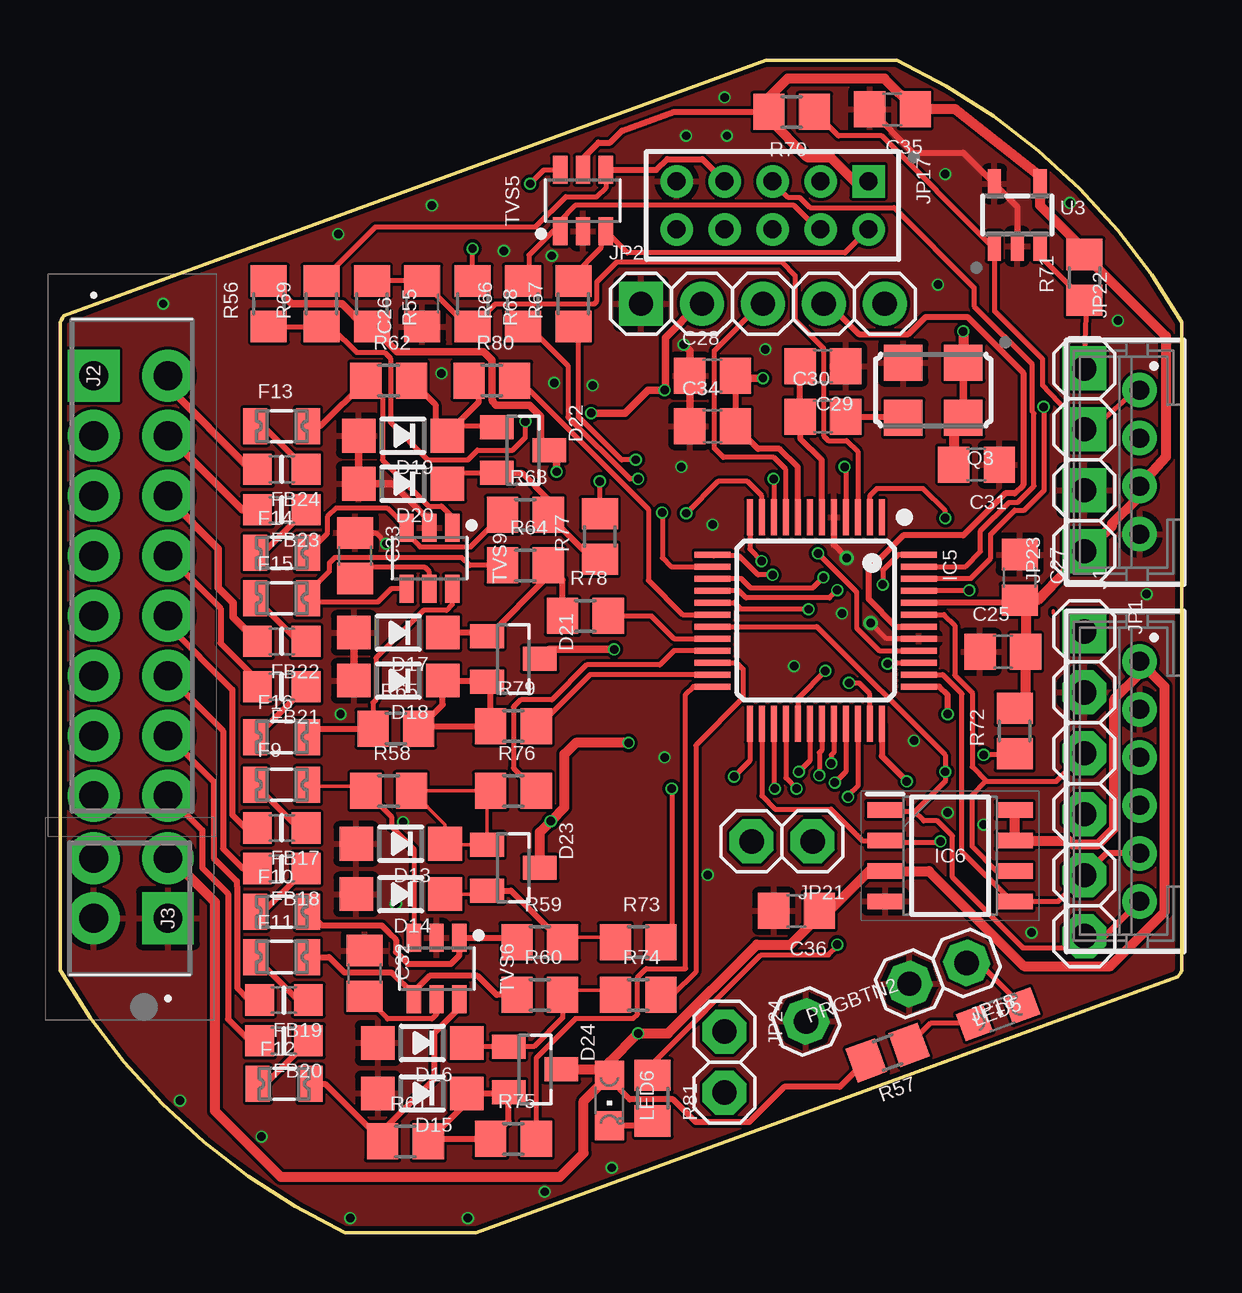
[diagram p3: board, top side]
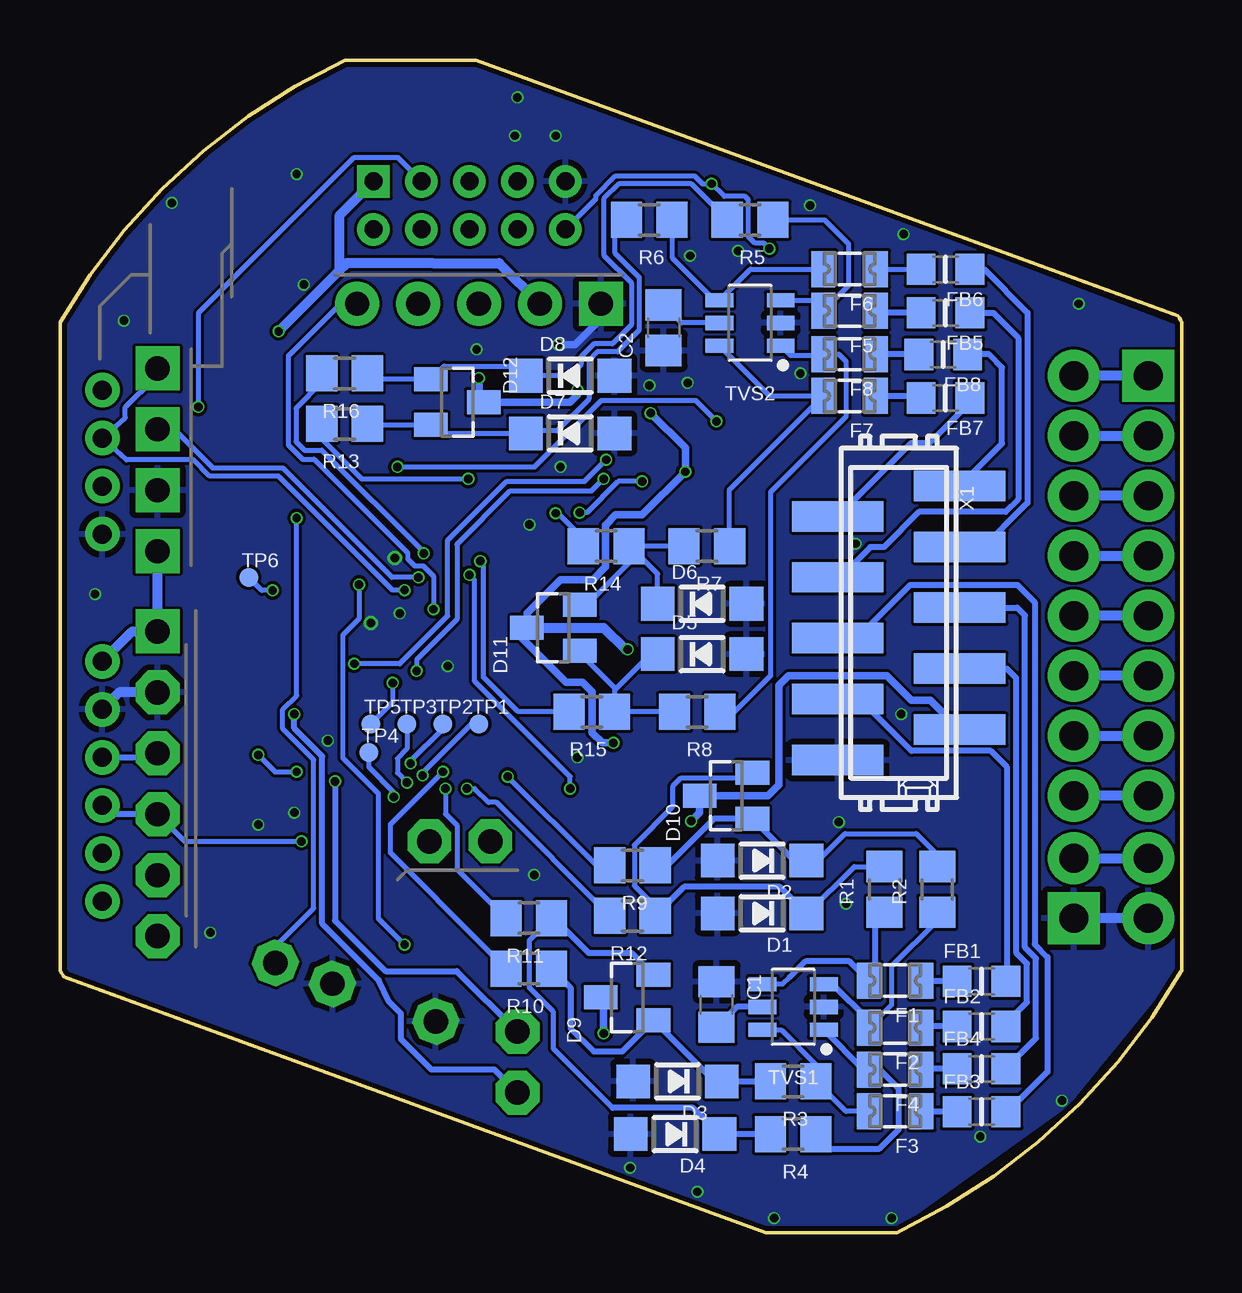
[diagram p4: board, bottom side, seen from below]

Size 46.77 x 48.86 mm. Coordinates in mm from the lower left corner, seen from the top.
Outline: 11.88,0 17.34,0 46.6,10.65 arc1 46.77,10.93 46.77,37.93 arc35 34.88,48.86 29.43,48.86 0.16,38.21 arc1 0,37.93 0,10.93 arc35 11.88,0
Copper layers (1*16): Top 0.035mm / dielectric 1.6mm / Bottom 0.035mm
Design rules "jlcpcb-2layers": minimum track width 5mil, minimum drill 0.3mm, track to track 5mil, track to pad 5mil, pad to pad 5mil, via to via 5mil, smd to smd 5mil, copper to edge 0.2mm, drill to drill 6mil, minimum pad ring 10mil, minimum via ring 3mil, stop-mask expansion 4mil, vias tented up to drill 0mil, thermal gap 10mil

### Footprints (pad centres in the part's own frame; a part is rotated, then mirrored left to right if it is on the bottom)
C0805 = smd 1.3 x 1.5: 1 -0.95,0; 2 0.95,0
SOD-123 = smd 1.4 x 1.4: A 1.85,0; C -1.85,0
SOT23 = smd 1 x 1.4: 1 -0.95,-1.1; 2 0.95,-1.1; 3 0,1.1
0805L = smd 1 x 1.5: 1 -1.1,0; 2 1.1,0
FERR_0805MP = smd 1.2 x 1.3: 1 -1.016,0; 2 1.016,0
LQFP48 = smd 1.5 x 0.25: 1 -4.3,2.75; 2 -4.3,2.25; 3 -4.3,1.75; 4 -4.3,1.25; 5 -4.3,0.75; 6 -4.3,0.25; 7 -4.3,-0.25; 8 -4.3,-0.75; 9 -4.3,-1.25; 10 -4.3,-1.75; 11 -4.3,-2.25; 12 -4.3,-2.75; 25 4.3,-2.75; 26 4.3,-2.25; 27 4.3,-1.75; 28 4.3,-1.25; 29 4.3,-0.75; 30 4.3,-0.25; 31 4.3,0.25; 32 4.3,0.75; 33 4.3,1.25; 34 4.3,1.75; 35 4.3,2.25; 36 4.3,2.75 | smd 0.25 x 1.5: 13 -2.75,-4.3; 14 -2.25,-4.3; 15 -1.75,-4.3; 16 -1.25,-4.3; 17 -0.75,-4.3; 18 -0.25,-4.3; 19 0.25,-4.3; 20 0.75,-4.3; 21 1.25,-4.3; 22 1.75,-4.3; 23 2.25,-4.3; 24 2.75,-4.3; 37 2.75,4.3; 38 2.25,4.3; 39 1.75,4.3; 40 1.25,4.3; 41 0.75,4.3; 42 0.25,4.3; 43 -0.25,4.3; 44 -0.75,4.3; 45 -1.25,4.3; 46 -1.75,4.3; 47 -2.25,4.3; 48 -2.75,4.3
SOIC127P600X175-8N = smd 1.5 x 0.65: 1 -2.7,1.905; 2 -2.7,0.635; 3 -2.7,-0.635; 4 -2.7,-1.905; 5 2.7,-1.905; 6 2.7,-0.635; 7 2.7,0.635; 8 2.7,1.905
62000611622 = drill 0.8: 1 5,-0.6; 2 3,-0.6; 3 1,-0.6; 4 -1,-0.6; 5 -3,-0.6; 6 -5,-0.6
1771017 = drill 1.2 pad 1.8 square: 1 0,0 | drill 1.2 pad 1.8: 2 0,3.1; 3 2.5,0; 4 2.5,3.1; 5 5,0; 6 5,3.1; 7 7.5,0; 8 7.5,3.1; 9 10,0; 10 10,3.1; 11 12.5,0; 12 12.5,3.1; 13 15,0; 14 15,3.1; 15 17.5,0; 16 17.5,3.1
1770953 = drill 1.2 pad 1.8 square: 1 0,0 | drill 1.2 pad 1.8: 2 0,3.1; 3 2.5,0; 4 2.5,3.1
1X06-S = drill 1.016 square: 1 -6.35,0 | drill 1.016 octagon: 2 -3.81,0; 3 -1.27,0; 4 1.27,0; 5 3.81,0; 6 6.35,0
1X05 = drill 1.016 square: 1 -5.08,0 | drill 1.016: 2 -2.54,0; 3 0,0; 4 2.54,0; 5 5.08,0
2X05M = drill 0.75 pad 1.27 square: 1 -4,-1 | drill 0.75 pad 1.27: 2 -4,1; 3 -2,-1; 4 -2,1; 5 0,-1; 6 0,1; 7 2,-1; 8 2,1; 9 4,-1; 10 4,1
1X02 = drill 1.016 pad 1.676 octagon: 1 -1.27,0; 2 1.27,0
62000411622 = drill 0.8: 1 3,-0.6; 2 1,-0.6; 3 -1,-0.6; 4 -3,-0.6
1X04 = drill 1.016 square: 1 -3.81,0; 2 -1.27,0; 3 1.27,0; 4 3.81,0
CHIPLED_0805 = smd 1.2 x 1.2: A 0,-1.05; C 0,1.05
1X01 = drill 1.016 octagon: 1 0,0
ASF = smd 1.6 x 1.5: 1 -1.25,-1.15; 2 1.25,-1.15; 3 1.25,1.15; 4 -1.25,1.15
R0805 = smd 1.3 x 1.5: 1 -0.95,0; 2 0.95,0
TP08R = smd 0.8 x 0.8: TP 0,0
SOT-23-6L = smd 1.165 x 0.597: 1 -1.275,0.95; 2 -1.275,0; 3 -1.275,-0.95; 4 1.275,-0.95; 5 1.275,0; 6 1.275,0.95
SOT23-5 = smd 0.55 x 1.2: 1 -0.95,-1.3; 2 0,-1.3; 3 0.95,-1.3; 4 0.95,1.3; 5 -0.95,1.3
MICROMATCH-10SMD = smd 1.27 x 3.81: 1 5.715,-2.54; 2 4.445,2.54; 3 3.175,-2.54; 4 1.905,2.54; 5 0.635,-2.54; 6 -0.635,2.54; 7 -1.905,-2.54; 8 -3.175,2.54; 9 -4.445,-2.54; 10 -5.715,2.54

### Placement (x,y rotation side)
C1  19.4,9.5 270 bottom
C2  21.6,37.7 90 bottom
C25  39.3,24.2 0 top
C26  15.1,38.7 90 top
C27  40,27.3 270 top
C28  27.2,35.7 0 top
C29  31.8,36.1 180 top
C30  31.8,34 0 top
C31  38.2,32 180 top
C32  12.7,10.8 270 top
C33  12.3,28.2 270 top
C34  27.2,33.6 0 top
C35  34.7,46.8 180 top
C36  30.7,13.4 180 top
D1  17.5,13.3 180 bottom
D2  17.5,15.5 180 bottom
D3  21.02,6.3 180 bottom
D4  21.12,4.1 180 bottom
D5  20,24.1 0 bottom
D6  20,26.2 0 bottom
D7  25.5,33.3 0 bottom
D8  25.5,35.7 0 bottom
D9  23.12,9.8 90 bottom
D10  19,18.2 90 bottom
D11  26.2,25.2 90 bottom
D12  30.2,34.6 270 bottom
D13  14.2,16.2 180 top
D14  14.2,14.1 180 top
D15  15.1,5.8 180 top
D16  15.1,7.9 180 top
D17  14.1,25 180 top
D18  14.1,23 180 top
D19  14.3,33.2 180 top
D20  14.3,31.2 180 top
D21  18.9,23.9 270 top
D22  19.3,32.6 270 top
D23  18.9,15.2 270 top
D24  19.8,6.8 270 top
F1  11.95,10.5 180 bottom
F2  11.95,8.54 180 bottom
F3  11.95,5.05 180 bottom
F4  11.95,6.79 180 bottom
F5  13.85,38.41 180 bottom
F6  13.85,40.15 180 bottom
F7  13.85,34.86 180 bottom
F8  13.85,36.6 180 bottom
F9  9.24,18.65 0 top
F10  9.24,13.37 0 top
F11  9.24,11.48 0 top
F12  9.34,6.2 0 top
F13  9.24,33.6 0 top
F14  9.24,28.32 0 top
F15  9.24,26.43 0 top
F16  9.24,20.65 0 top
FB1  8.35,10.47 0 bottom
FB2  8.35,8.59 0 bottom
FB3  8.35,5.03 0 bottom
FB4  8.35,6.82 0 bottom
FB5  9.85,38.32 180 bottom
FB6  9.85,40.13 180 bottom
FB7  9.85,34.77 180 bottom
FB8  9.95,36.59 180 bottom
FB17  9.24,16.86 180 top
FB18  9.24,15.17 180 top
FB19  9.34,9.69 180 top
FB20  9.34,7.99 180 top
FB21  9.24,22.74 180 top
FB22  9.24,24.63 180 top
FB23  9.24,30.11 180 top
FB24  9.24,31.81 180 top
IC5  31.5,25.5 270 top
IC6  37.1,15.7 0 top
J1  44.4,18.8 90 top
J2  1.4,35.7 270 top
J3  4.5,13.1 90 top
JP1  42.7,18.7 270 top
JP2  29.3,38.7 0 top
JP17  29.7,42.8 180 top
JP18  36.6,10.8 200 top
JP21  30.1,16.3 180 top
JP22  44.4,32.1 90 top
JP23  42.7,32.2 90 top
JP24  27.7,7.1 270 top
LED5  39.1,9.1 290 top
LED6  22.9,5.5 180 top
PRGBTN2  31.1,8.8 110 top
Q3  36.4,35.1 180 top
R1  12.4,14.3 90 bottom
R2  10.2,14.3 90 bottom
R3  16.2,6.3 180 bottom
R4  16.2,4.1 180 bottom
R5  18,42.2 180 bottom
R6  22.2,42.2 180 bottom
R7  19.8,28.6 180 bottom
R8  20.2,21.7 180 bottom
R9  22.9,15.3 180 bottom
R10  27.22,11 180 bottom
R11  27.22,13.1 180 bottom
R12  22.9,13.2 180 bottom
R13  34.9,33.7 180 bottom
R14  24,28.6 180 bottom
R15  24.6,21.7 180 bottom
R16  34.9,35.8 180 bottom
R55  13,38.7 270 top
R56  8.7,38.7 90 top
R57  34.5,7.5 200 top
R58  13.7,18.4 0 top
R59  20,12.1 0 top
R60  20,9.9 0 top
R61  14.4,3.8 0 top
R62  13.7,35.5 0 top
R63  19.4,29.9 0 top
R64  19.4,27.8 0 top
R65  14,21 0 top
R66  19.3,38.7 90 top
R67  21.4,38.7 90 top
R68  17.2,38.7 270 top
R69  10.9,38.7 90 top
R70  30.5,46.7 180 top
R71  42.7,39.8 90 top
R72  39.8,20.9 90 top
R73  24.1,12.1 0 top
R74  24.1,9.9 0 top
R75  18.9,3.9 0 top
R76  18.9,18.4 0 top
R77  22.5,29 90 top
R78  21.9,25.7 0 top
R79  18.9,21.1 0 top
R80  18,35.5 0 top
R81  24.7,5.6 270 top
TP1  29.3,21.2 0 bottom
TP2  30.8,21.2 0 bottom
TP3  32.3,21.2 0 bottom
TP4  33.9,20 0 bottom
TP5  33.8,21.2 0 bottom
TP6  38.9,27.3 0 bottom
TVS1  16.2,9.4 180 bottom
TVS2  18,37.9 180 bottom
TVS5  21.8,43 90 top
TVS6  15.7,11 270 top
TVS9  15.4,28.1 270 top
U3  39.9,42.4 0 top
X1  11.8,25.4 270 bottom

### Tracks (layer width: path | path; a pad name or v marks a point on that pad's centre or on a via)
+3V3  (via drill 0.35)
  Top 0.254: IC5.8 30.75,31.9 30,32.65 29.1,32.65 C34.2 28.15,35.6 C28.2 | C27.2 39.9,26.25 IC5.44 | TVS5.5 21.8,44.77 22.45,45.41 22.94,45.41 23.44,45.91 25.6,46.7 R70.2 | R57.2 32.51,6.08 30.2,6.08 28.72,4.6 26.51,4.6 25.55,5.55 23.75,5.55 22.9,6.4 LED6.A
  Top 0.305: v20.7,31.7 20.7,32.6 D22.3 20.03,32.97 20.03,34.02 19.58,34.47 18.18,34.47 18.02,34.63 18.02,34.68 18,34.7 18,36.35 17.65,36.7 14.05,36.7 R55.2 12.7,37.75 11.75,38.7 9.65,38.7 R56.2 | v29.3,35.6 28.15,35.6 | v22.14,34.14 23.54,34.14 24.5,35.1 v25.2,35.1 25.23,35.13 25.23,37.29 26.64,38.7 JP2.2 | Q3.1 Q3.4 37.25,33.55 | D21.3 20.4,24.3 v23.1,24.3 | 40.76,26.35 C27.2 40.25,26.1
  Top 0.406: v37.65,37.55 Q3.1 | D23.3 20,16.68 v20.46,17.14 21.03,17.71 21.03,19.93 21.5,20.4 v23.7,20.4 | LED6.A 21.83,5.48 21.83,3.31 20.84,2.32 9.21,2.32 6.91,4.61 6.45,5.08 6.45,13.78 4.63,15.6 J3.3 | D24.3 22.65,6.8 LED6.A | LED6.A 22.9,7.1 v24.1,8.3 25.35,8.3 29.05,12 30.45,12 31.65,13.2 C36.1 32.06,13.4 33.73,15.06 IC6.3 36.23,15.06 40.19,11.11 43.79,11.11 46.05,13.37 46.05,22.75 J1.1 45,23.29 43.95,22.23 43.95,16.85 43.28,16.18 42.18,16.18 42.03,16.34 IC6.7 IC6.8 | 37.25,33.55 C31.2 | 40.76,26.35 JP23.1 43.85,29.44 43.85,29.54 44.9,30.59 JP22.3 46.1,32.31 46.1,37.35 R71.2 42.7,40.95 40.85,42.8 U3.4 40.85,44.03 37.38,46.77 37.35,46.8 C35.1 34.37,48.08 30.33,48.08 29.55,47.3 R70.2 29.55,46.4 31.14,44.8 32.12,44.8 33.12,43.8 JP17.1 | 40.25,26.1 C25.2 40.25,22.3 R72.2
  Bottom 0.305: v20.46,17.14 20.1,17.5 D10.3 17.25,18.2 16.8,18.66 16.8,22.8 16.4,23.2 12.3,23.2 11.28,22.18 10.49,22.18 X1.2 | D9.3 24.1,9.68 v24.1,8.3 | v29.3,35.6 29.3,34.8 D12.3 25.5,34.6 25.2,34.9 v25.2,35.1 | v22.14,34.14 20.7,32.7 v20.7,31.7 22.5,29.9 23.6,29.9 24.02,29.48 24.02,27.73 24.55,27.2 25.9,27.2 27.3,25.8 D11.3 27.5,25 27.5,24.75 25.68,22.93 24.98,22.93 24.58,22.52 24.58,20.83 24.14,20.4 v23.7,20.4
  Bottom 0.406: v37.65,37.55 35.11,40.09 | 35.11,40.09 34.81,40.39 33.84,40.39 31.24,40.39 28.45,40.39 JP2.2 | D11.3 24.1,25.2 23.2,24.3 v23.1,24.3 | JP23.1 JP1.1 43.75,25.05 J1.1 | 35.11,40.09 35.11,42.39 JP17.1 | J3.3 J3.4
BUS_V
  Top 0.254: IC5.42 34.85,25.25 33.7,26.4 33.7,27.6 35.15,29.05 37.65,29.05 39.4,30.8 39.8,30.8 40.15,31.15 40.15,35.82 37.81,38.16 36.09,38.16 35.36,37.43 33.3,37.43 32.03,38.7 JP2.4
DBG_RXD  (via drill 0.35)
  Top 0.254: v37,21.6 37,22.4 36.65,22.75 IC5.37
  Bottom 0.254: JP24.2 28.67,6.8 31.29,6.8 32.56,8.08 32.56,9.13 33.06,9.63 33.48,10.52 35.83,12.88 35.83,19.84 37,21.01 v37,21.6
DBG_TXD  (via drill 0.35)
  Top 0.254: IC5.36 34.25,19.85 v35.3,18.8
  Bottom 0.254: v35.3,18.8 35.3,13 33.2,10.89 30.23,10.89 JP24.1
EIB_IN
  Top 0.2: IC5.9 30.25,31.8 29.75,32.3 27.65,32.3 27.27,32.68 27.27,36.74 29.23,38.7 JP2.3
EIB_OUT  (via drill 0.35)
  Top 0.2: v31.2,25.97 28.38,25.97 28.1,26.25 IC5.17
  Bottom 0.2: JP2.5 34.48,38.8 34.97,38.8 37.25,36.52 37.25,32.82 36.66,32.23 36.18,32.23 32.27,28.32 32.27,28.07 31.98,27.78 31.62,27.78 31.2,27.35 v31.2,25.97
GND  (via drill 0.35, 0.35 pad 0.6)
  Top 0.2: C33.1 13.15,29.15 v13.6,28.7 | IC5.41 34.45,24.75 v33.8,25.4
  Top 0.254: v32.8,28.1 32.25,28.65 IC5.5 | TVS9.2 15.4,29.66 13.87,31.2 13.8,31.2 | C35.2 35.55,45 37.65,45 U3.5 39.9,42.75 U3.2
  Top 0.305: 13.8,31.2 D20.A D19.A | D18.A D17.A | C34.1 C28.1 26.25,36.75 v26,37
  Bottom 0.305: JP2.1 24.22,38.08 25.3,37 v26,37
  Bottom 0.406: JP1.2 44.29,22.51 J1.2 | J3.2 J3.1
  other vias: 14,13.7 15.9,35.8 25.9,31.9 44.1,38 15.5,42.8 27.7,47.3 14.3,17.1 20.5,40.7 11.6,41.6 4.3,38.7 37,17.5 35.6,20.5 25.2,19.8 32.6,25.8 11.7,21.6 5,5.5 8.4,4 12.1,0.6 17,0.6 20.2,1.7 23,2.7 27,14.9 27.2,29.5 22.2,35.3 45.3,26.6 42.1,42.9 36.9,44.1 18.5,40.9 20.6,35.4 36.6,39.5 29.4,36.8 40.5,12.5 38.5,17 26.1,45.7 27.8,45.7 30.6,23.6
  pour Top: 11.76,0 17.45,0 46.51,10.55 46.8,10.93 46.8,38.15 41.72,44.41 35.31,48.9 29.38,48.9 0,37.74 0,10.4 3.92,5.6
  pour Bottom: 12.16,0 17.45,0 46.44,10.53 46.8,11 46.8,38.1 41.54,44.57 35.37,48.9 29.48,48.9 0,37.71 0,11.14 4.82,5.24
IN1
  Top 0.305: FB24.2 7.93,31.81 4.5,35.23 J2.2
  Bottom 0.406: J2.1 J2.2
IN2
  Top 0.305: FB23.2 7.59,30.11 J2.4
  Bottom 0.406: J2.4 J2.3
IN3
  Top 0.305: FB22.2 7.23,25.63 7.23,26.23 6.6,26.86 6.6,28.5 4.5,30.6 J2.6
  Bottom 0.406: J2.5 J2.6
IN4
  Top 0.254: J2.8 6.69,26.01 6.69,24.56 8.23,23.02 FB21.2
  Bottom 0.406: J2.8 J2.7
IN5
  Top 0.254: J2.10 4.5,25.3 7.18,22.62 7.18,17.4 7.72,16.86 FB17.2
  Bottom 0.406: J2.9 J2.10
IN6
  Top 0.254: J2.12 6.8,20.9 6.8,15.99 7.63,15.17 FB18.2
  Bottom 0.406: J2.11 J2.12
IN7
  Top 0.254: J2.14 6.42,18.79 6.42,15.6 7.37,14.64 7.37,14.41 7.39,14.39 7.39,10.19 7.89,9.69 FB19.2
  Bottom 0.406: J2.14 J2.13
IN8
  Top 0.254: J2.16 5.93,16.77 5.93,15.2 7.01,14.13 7.01,8.89 7.91,7.99 FB20.2
  Bottom 0.406: J2.15 J2.16
IN9
  Bottom 0.254: FB1.2 7.3,10.51 7.3,19.4 7.97,20.07 11.27,20.07 13.43,22.23 X1.3
IN10
  Bottom 0.254: X1.4 7.3,23.5 6.92,23.11 6.92,11.67 6.46,11.21 6.46,9.6 7.33,8.73 FB2.2
IN11
  Bottom 0.254: X1.5 13.54,24.77 11.32,26.98 6.85,26.98 6.13,26.27 6.13,12.02 5.6,11.48 5.6,6.7 7.27,5.03 FB3.2
IN12
  Bottom 0.254: X1.6 6.86,26.04 6.54,25.71 6.54,11.88 6.08,11.42 6.08,8.1 7.33,6.85 FB4.2
IN13
  Bottom 0.254: X1.7 14.24,27.3 12.99,28.56 12.43,28.56 10.96,30.03 7.35,30.03 6.82,30.56 6.82,37.28 7.86,38.32 FB5.1
IN14
  Bottom 0.254: X1.8 9.06,28.38 8.46,28.38 6.44,30.4 6.44,38.33 8.24,40.13 FB6.1
IN15
  Bottom 0.254: X1.9 11.29,32.9 10.51,32.9 8.83,34.57 FB7.1
IN16
  Bottom 0.254: X1.10 7.5,32.88 7.5,36.05 8.03,36.59 FB8.1
IO1
  Top 0.2: R80.2 19.35,35.1 19.57,35.1 24.53,30.14 24.53,27.17 25.95,25.75 IC5.18
IO1R
  Top 0.2: D19.C 16.55,33.6 18.15,33.6 D22.1
  Top 0.254: R80.1 17.45,35.1 17.45,34.6 16.15,33.3 D19.C 15.65,33.7 15.65,34.5 R62.2
IO2  (via drill 0.35)
  Top 0.2: IC5.14 25.47,27.75 25.11,28.11 25.11,29.99 v25.1,30 | R77.2 v22.5,31.3
  Bottom 0.2: v25.1,30 24.8,30 23.5,31.3 v22.5,31.3
IO2R
  Top 0.2: D20.C 16.6,31.65 D22.2
  Top 0.254: D22.2 19.25,31.65 20.35,30.55 R63.2 22.2,28.05 R77.1
IO3
  Top 0.2: R78.2 24.64,25.7 25.59,24.75 IC5.20
IO3R
  Top 0.254: D17.C 17.65,25 D21.1 17.86,24.85 20.35,27.34 R64.2 20.95,27.2 R78.1
IO4
  Top 0.2: IC5.23 22.1,23.25 19.95,21.1 R79.2
IO4R
  Top 0.254: 17.95,23 D18.C 15.95,22 R65.2 15.05,21.1 R79.1 17.95,23 | D21.2 17.9,23.05 17.95,23
IO5
  Top 0.2: IC5.21 25.6,24.25 25,23.65 21.95,23.65 20.5,22.2 19.2,22.2 18.9,21.9 18.9,19.35 R76.2
IO5R
  Top 0.152: R58.2 16.05,17 D13.C 16.1,16.15 D23.1 17.8,18.25 R76.1 R58.2
IO6  (via drill 0.35)
  Top 0.2: v25.5,18.5 25.5,12.55 R73.2 | v29.7,27.4 29.1,27.4 28.3,28.2 27.25,28.2 IC5.13
  Bottom 0.2: v25.5,18.5 25.5,19 29.5,23 29.5,27.2 v29.7,27.4
IO6R
  Top 0.152: D14.C 17.65,14.1 D23.2 | R73.1 22.95,12.3 21.15,12.3 R59.2
  Top 0.254: D23.2 18.8,14.25 R59.2
IO7
  Top 0.2: IC5.22 28.2,23.75 28.48,23.47 28.48,22.28 26.5,20.3 26.5,10.85 25.55,9.9 R74.2
IO7R
  Top 0.152: R74.1 22.95,10.1 21.15,10.1 R60.2
  Top 0.2: D16.C 17.1,7.75 D24.1 19.75,7.75 20.95,8.95 R60.2
IO8
  Top 0.2: R75.2 19.85,7.27 21.5,8.92 23.89,8.92 24.07,9.1 24.07,10.64 24.43,11 26.07,11 26.07,22.42 26.4,22.75 IC5.24
IO8R
  Top 0.254: R61.2 15.45,3.9 R75.1 18.7,4.65 D24.2 18.65,5.8 D15.C 16.95,5.4 R61.2
IO9  (via drill 0.35)
  Top 0.2: IC5.27 29.75,18.55 v29.8,18.5
  Bottom 0.2: v29.8,18.5 29.48,18.5 28.9,17.92 28.57,17.92 R12.2
IO10  (via drill 0.35)
  Top 0.2: IC5.25 28.75,19.65 v28.1,19
  Bottom 0.2: R9.2 24.4,15.3 v28.1,19
IO11  (via drill 0.35)
  Top 0.2: IC5.30 31.25,19.65 v30.8,19.2
  Bottom 0.2: R10.2 31.02,13.85 31.02,13.87 33,15.84 33,17 v30.8,19.2
IO12  (via drill 0.35)
  Top 0.2: IC5.28 30.25,18.95 v30.7,18.5
  Bottom 0.2: v30.7,18.5 30.7,17.44 30.22,16.97 30.22,15.15 R11.2
IO13  (via drill 0.35)
  Top 0.2: v31.6,28.3 33.2,26.7 33.2,25.2 34.15,24.25 IC5.40
  Bottom 0.2: R16.2 35.85,35.42 36.93,34.34 36.93,32.96 36.57,32.6 35.85,32.6 31.58,28.32 v31.6,28.3
IO14  (via drill 0.35)
  Top 0.2: v29.75,31.4 v29.75,31.39 IC5.10
  Bottom 0.2: R13.2 35.95,33.7 36.22,33.43 34.19,31.4 v29.75,31.4
IO15  (via drill 0.35)
  Top 0.2: v26.1,29.97 27.43,31.3 28.65,31.3 29.25,30.7 IC5.11
  Bottom 0.2: v26.1,29.97 26,29.97 24.95,28.92 R14.2
IO16  (via drill 0.35)
  Top 0.2: IC5.12 28.75,28.47 v29.24,27.98
  Bottom 0.2: v29.24,27.98 29.13,27.86 29.13,23.15 27.7,21.72 25.57,21.72 R15.2
ISP_EN  (via drill 0.35)
  Top 0.2: v32.7,31.9 32.75,31.85 IC5.4 | v19.4,33.8 19.4,33.13 18.87,32.6 17.4,32.6 17,32.2 15.33,32.2 13.77,33.76 13.77,36.43 13.53,36.67 12.36,36.67 11.28,37.75 R69.1 R56.1
  Bottom 0.2: v32.7,31.9 26.98,31.9 24.2,34.68 20.28,34.68 v19.4,33.8
ISP_RXD  (via drill 0.35)
  Top 0.2: v41,34.4 41.02,34.38 41.02,30.92 40.2,30.1 39.8,30.1 38.8,29.1 38.8,28.1 37.95,27.25 IC5.46
  Bottom 0.2: JP17.3 32.7,44.8 34.5,44.8 41,38.3 v41,34.4
ISP_TXD
  Top 0.2: JP17.5 30.37,43.13 30.84,43.13 31.26,42.7 34.77,42.7 38.1,39.38 38.1,38.6 40.52,36.18 40.52,34.2 40.6,34.12 40.6,31.1 39.93,30.43 39.56,30.43 38.37,29.23 38.37,28.37 37.75,27.75 IC5.47
MISO1  (via drill 0.35)
  Top 0.2: IC5.26 29.25,18.2 29.81,17.64 32.14,17.64 33.45,16.34 IC6.2 34.5,16.23 36.63,16.23 v36.7,16.3
  Bottom 0.2: JP1.4 41.57,16.3 v36.7,16.3
  Bottom 0.254: JP1.4 44.63,17.43 J1.4
MOSI1
  Top 0.2: IC5.38 36.8,23.25 37.6,22.45 37.6,15.87 39.67,13.79 IC6.5 41.6,13.79 JP1.5
  Top 0.254: J1.5 43.61,15.8 JP1.5
N$1
  Top 0.254: C30.2 35.1,34 Q3.3
N$2
  Top 0.2: R62.1 13.45,34.8 13.45,32.18 15.36,30.27 15.9,30.27 16.35,29.83 TVS9.1
  Top 0.254: R62.1 10.85,33.6 F13.2
N$3
  Top 0.2: F14.2 11.14,29.12 11.14,29.82 11.52,30.2 13.62,30.2 TVS9.3 14.45,29.12 15.01,28.57 17.12,28.57 R63.1
N$4
  Top 0.152: 13.38,3.88 R61.1
  Top 0.254: F12.2 11.05,6.2 13.38,3.88 | TVS6.6 16.65,9.36 15.61,8.32 15.61,6.4 13.45,4.24 R61.1
N$5
  Top 0.152: R58.1 12.55,18.6 10.39,18.6 F9.2
  Top 0.2: R58.1 13.82,17.33 13.82,16.9 14.75,15.97 TVS6.3
N$6
  Bottom 0.254: FB5.2 12.66,38.32 F5.1
N$7
  Bottom 0.2: F6.1 12.74,40.13 FB6.2
N$8
  Bottom 0.254: F7.1 11.47,34.86 FB7.2
N$9
  Bottom 0.254: F8.1 12.74,36.59 FB8.2
N$10
  Bottom 0.2: TVS2.3 15.32,38.85 14.95,38.48 F5.2 13.9,39.46 13.9,41.2 14.9,42.2 R5.1
N$11
  Top 0.254: R59.1 18.88,12.28 TVS6.1 16.65,11.55 16.3,11.2 14.5,11.2 14,11.7 14,12.2 13.7,12.5 13.7,12.51 13.41,12.8 10.91,12.8 F10.2
N$12
  Bottom 0.2: F6.2 17.98,40.15 TVS2.4 19.48,38.85 21.25,40.62 R6.1
N$13
  Top 0.2: TVS9.4 13.8,26.82 13.24,26.27 10.5,26.27 F15.2 10.34,26.67 11.22,27.55 11.22,27.89 11.46,28.13 16.75,28.13 17.08,27.8 R64.1
N$14
  Bottom 0.2: TVS2.6 17.18,34.86 F7.2 18.85,30.96 R7.1
N$15
  Top 0.254: R60.1 18.2,9.9 17.4,10.7 15.4,10.7 14.75,10.05 14.75,9.9 | 14.75,9.9 TVS6.4 | 14.75,9.9 13.8,10.85 11.85,10.85 11.21,11.48 F11.2
N$16
  Top 0.2: TVS9.6 16.35,26.17 16.1,25.93 15.16,25.93 13.18,23.95 13.18,22.21 13.05,22.08 R65.1
  Top 0.254: F16.2 10.7,21 R65.1
N$17
  Bottom 0.2: TVS2.1 16.32,36.55 15,36.55 F8.2 14.3,36.6 14,36.3 14,34 17.15,30.85 17.15,23.2 18.65,21.7 R8.1
N$18
  Bottom 0.2: R16.1 33.7,35.55 D12.1 30.75,36.1 27.75,36.1 D8.C 25.5,35.7 25.05,36.15 25.05,36.48 24.51,37.03 23.74,37.03 22.95,37.82 22.95,39.58 24.1,40.73 24.1,43.07 23.47,43.7 20.45,43.7 R5.2
N$19
  Bottom 0.2: R13.1 33.9,33.65 D12.2 30.95,33.3 D7.C 27.25,33.4 26.05,33.4 24.72,34.73 24.72,36.35 24.37,36.7 23.52,36.7 22.62,37.6 22.62,39.8 23.65,40.83 23.65,41.7 R6.2
N$20  (via drill 0.35)
  Top 0.2: IC5.45 v37.9,26.75
  Bottom 0.2: v37.9,26.75 38.35,26.75 TP6.TP
N$26
  Top 0.2: R57.1 36.31,8.74 LED5.A
N$27  (via drill 0.35)
  Top 0.2: IC5.32 32.25,20 32.15,19.9 v32.15,19.55
  Bottom 0.2: TP2.TP 30.8,21 32.15,19.65 v32.15,19.55
N$28
  Top 0.2: TVS6.5 15.7,9.1 15.5,8.9 13.65,8.9 C32.2
N$29
  Top 0.2: C33.2 12.4,27.25 12.87,27.71 15.21,27.71 15.4,27.52 TVS9.5
N$30
  Top 0.152: 10.2,9.69 FB19.1
  Top 0.254: F11.1 9.94,9.69 10.2,9.69
N$31
  Top 0.254: FB20.1 8.56,6.2 F12.1
N$32
  Top 0.254: FB18.1 8.46,13.37 F10.1
N$33
  Top 0.254: F9.1 9.94,16.86 FB17.1
N$34
  Top 0.254: FB21.1 8.16,20.65 F16.1
N$35
  Top 0.254: FB22.1 9.94,24.63 F15.1
N$36
  Top 0.254: FB24.1 8.46,33.6 F13.1
N$37
  Top 0.254: FB23.1 8.46,28.32 F14.1
N$38
  Top 0.254: R81.2 24.5,4.45 LED6.C
N$39  (via drill 0.35)
  Top 0.2: IC5.48 34.95,28.25 34.3,27.6 v34.3,27 | R81.1 24.7,7.04 29.23,11.57 32.04,11.57 32.4,11.93 v32.4,12
  Bottom 0.2: v34.3,27 34.3,25.58 34.98,24.9 34.98,19.78 33.5,18.3 33.5,13.1 v32.4,12
N$43
  Bottom 0.2: R7.2 23,28.6 | 23,28.6 R14.1 23.05,27.9 24.8,26.15 D11.2 | D6.C 21.85,27.45 23,28.6
N$44
  Bottom 0.2: R8.2 R15.1 | D5.C 22.15,24.1 23.65,22.6 R15.1 | D11.1 25.1,24.15 23.65,22.7 R15.1
N$45
  Bottom 0.254: TVS1.5 18.55,9.4 C1.2
N$46  (via drill 0.35)
  Top 0.2: v32.3,18.75 32.75,19.2 IC5.33
  Bottom 0.2: TP3.TP 32.3,20.15 32.7,19.75 32.7,19.15 v32.3,18.75
N$47
  Bottom 0.254: FB1.1 9.39,10.5 F1.1
N$48
  Bottom 0.254: FB2.1 10.8,8.59 F2.1
N$49
  Bottom 0.254: FB3.1 10.83,5.03 F3.1
N$50
  Bottom 0.254: FB4.1 10.82,6.82 F4.1
N$51
  Bottom 0.254: TVS1.1 13.27,6.79 F4.2 12.59,6.79 11.8,6 11.8,4.3 12.6,3.5 14.65,3.5 R4.1
N$52
  Bottom 0.2: F3.2 14,5.05 R3.1 15.25,7 16.7,8.45 TVS1.6
N$53
  Bottom 0.2: R2.1 10.2,13 12.1,11.1 12.1,9.49 F2.2
  Bottom 0.254: F2.2 13.05,8.84 14.56,10.35 TVS1.3
N$54
  Bottom 0.2: 16.34,10.65 16.64,10.35 TVS1.4
  Bottom 0.254: 16.34,10.65 15.69,11.3 13.85,11.3 F1.2 12.8,10.75 12.8,12.95 R1.1
N$55
  Bottom 0.2: D10.2 18.12,18.93 20.89,18.93 21.23,18.59 21.23,17.74 22.83,16.14 22.83,14.46 21.95,13.58 R12.1 | R1.2 13.66,15.25 15.61,13.3 D1.C
  Bottom 0.254: D1.C 16.75,14.4 20.75,14.4 R12.1
N$56
  Bottom 0.2: D2.C 15.17,15.5 14.04,16.63 11.08,16.63 10.2,15.75 R2.2
  Bottom 0.254: D2.C 16.15,15.5 D10.1 19.5,17.25 21.45,15.3 R9.1
N$57
  Bottom 0.254: R3.2 D3.C 19.47,6.3 D9.1 23.32,7.55 24.52,7.55 25.47,8.5 25.47,10.2 R10.1
N$58
  Bottom 0.2: 23.73,5.2 26.2,7.67 26.2,9.2 27.2,10.2 27.2,12.17 R11.1
  Bottom 0.254: R11.1 26.17,13.1 24.72,11.65 22.92,11.65 D9.2 | 23.73,5.2 20.37,5.2 D4.C R4.2
N$59
  Bottom 0.2: C2.2 20.85,37.9 TVS2.5
N$60  (via drill 0.35)
  Top 0.2: IC5.34 33.25,18.6 32.85,18.2 v32.85,18.15
  Bottom 0.2: TP4.TP 33.9,19.4 32.85,18.35 v32.85,18.15
N$61  (via drill 0.35)
  Top 0.2: v32.89,22.91 33.29,22.91 33.75,22.45 IC5.35
  Bottom 0.2: v32.89,22.91 32.89,22.11 TP5.TP
N$62  (via drill 0.35)
  Top 0.2: IC5.31 31.75,20.1 31.65,20 v31.65,19.05
  Bottom 0.2: v31.65,19.05 31.65,19.15 29.6,21.2 TP1.TP
N$63
  Top 0.152: 41.4,25.9 41.4,25.8
PROG  (via drill 0.35)
  Top 0.2: IC5.2 33.75,30.7 34.05,31 35.97,31 36.9,30.07 v36.9,29.77 | LED5.C 38.31,11.23 JP18.1
  Bottom 0.2: JP18.1 37.79,11.91 36.18,13.52 36.18,19.7 37.48,20.99 37.48,21.8 36.9,22.38 v36.9,29.77
RESET
  Top 0.2: R55.1 C26.2 17,37.75 R68.2 18.15,38.7 22.27,38.7 22.38,38.81 22.38,39.61 23.21,40.44 30.07,40.44 30.64,39.87 30.64,38.03 31.83,36.84 31.83,33.2 32.03,33 32.8,33 33.25,32.55 IC5.3
SCK1
  Top 0.2: IC5.43 36.85,25.75 37.3,25.3 37.3,23.22 38.02,22.5 38.02,19.4 38.62,18.8 | IC6.6 39.03,15.06 38.02,16.08 38.02,18.22 38.6,18.8 38.62,18.8 | JP1.3 41.53,18.8 38.62,18.8
  Bottom 0.254: J1.3 42.87,19.8 JP1.3
SCL  (via drill 0.35)
  Top 0.2: JP22.1 44.87,35.1 43.38,33.78 JP23.3 40.95,35.32 40.95,36.4 38.95,38.4 U3.1 38.85,41.1 34.25,45.7 32.45,45.7 R70.1 | IC5.15 28.4,27.25 28.8,26.85 31.37,26.85 v31.82,27.3
  Bottom 0.2: v31.82,27.3 32.92,27.3 37.47,31.85 40.38,31.85 42,33.47 JP23.3
SDA  (via drill 0.35)
  Top 0.2: U3.3 40.85,40.7 R71.1 42.8,38.75 JP23.4 | v32.4,26.77 32.08,26.45 28.6,26.45 28.3,26.75 IC5.16
  Bottom 0.2: JP23.4 42.8,35.62 44.04,34.38 44.04,33.96 JP22.2 44,32.2 41.19,32.2 40.52,31.52 37.65,31.52 32.9,26.77 v32.4,26.77
SSEL1  (via drill 0.35)
  Top 0.2: IC6.1 34.45,17.55 34.6,17.55 35.6,17.55 | 35.6,17.55 35.65,17.55 35.95,17.85 36.9,18.8 v36.9,19.2 36.9,19.9 31.55,25.25 IC5.19 | JP1.6 42.2,11.85 40.15,11.85 37.2,14.8 37.2,16.53 36.58,17.15 36,17.15 35.6,17.55 | R72.1 39.75,19.9 v38.5,19.9
  Top 0.254: J1.6 43.55,12.35 JP1.6
  Bottom 0.2: v38.5,19.9 37.8,19.2 v36.9,19.2
SWCLK  (via drill 0.35)
  Top 0.2: v24.1,31.4 23.75,31.4 21.18,33.98 21.18,36.12 19.55,37.75 R66.1 | v31.9,23.4 30.75,22.25 IC5.29
  Bottom 0.2: v24.1,31.4 24.6,30.9 28,30.9 30.22,28.68 30.22,25.55 31.9,23.88 v31.9,23.4
SWD_ISP_EN
  Top 0.2: R69.2 13.15,41.9 19.82,41.9 21.09,43.17 22.39,43.17 22.75,43.52 TVS5.4
  Top 0.254: TVS5.4 24.86,44.27 25.32,44.73 26.77,44.73 JP17.7
SWD_RESET  (via drill 0.35)
  Top 0.2: R68.1 v17.2,41 | v19.6,43.7 20.18,44.27 TVS5.6
  Bottom 0.2: v17.2,41 17.42,41.22 17.79,41.22 18.07,41.5 18.07,43.04 18.21,43.18 19.08,43.18 v19.6,43.7 19.99,43.7 20.32,44.03 23.61,44.03 24.43,43.21 24.43,43.07 JP17.10
SWD_SWCLK
  Top 0.2: JP17.4 31.6,41.8 30.6,42.8 21.47,42.8 20.8,42.13 20.8,41.73 | TVS5.1 20.8,41.73 | 20.8,41.73 20.55,41.73 19.55,40.73 19.55,39.65 R66.2
SWD_SWDIO
  Top 0.2: JP17.2 32.73,40.83 23.65,40.83 TVS5.3 22.55,41.52 22.55,41.02 22.51,40.99 21.4,39.88 R67.2
SWDIO  (via drill 0.35)
  Top 0.2: R67.1 21.6,37.55 21.6,34.01 23.41,32.2 v24,32.2 | v34.5,23.7 34.55,23.75 IC5.39
  Bottom 0.2: v24,32.2 24.9,31.3 28.15,31.3 30.6,28.85 30.6,25.7 32.6,23.7 v34.5,23.7
XTALIN
  Top 0.254: IC5.6 31.75,32.2 30.85,33.1 C30.1 C29.2

### Text on the board
tDocu: ISP | I2C / EEPROM | I2C | IO1 | IO8 | www.selfbus.org / IO module / 16x fused / v1.0.0 | SPI (SOIC8) | SPI | TXD / RXD | Prog-Button | Prog / LED | 3V3 / GND
bDocu: GND | +3V3 | GND | +3V3 | IN | BUSV | OUT | SDA / SCL / GND / 3V3 | SCL / SDA / 3V3 / GND | IN16 | IN15 | IN9 | +3V3 | GND | mount | 3V3 / / GND / / SCK1 / / MOSI1 / / MISO1 / / SSEL1